# Altium project PCB_3U_Kasli.PrjPCB (part 6 of 7)

## Sheet FPGA_SDRAM.SchDoc: =ProjectName
size 420 x 297 mm; Author: G.K.; CompanyName: WUT; DrawnBy: G.K. and P.K.; Organization: WUT ISE; Address1: Warsaw Univeristy of Technology; Address2: Nowowiejska 15/19; DocumentNumber: 8; Revision: 1.1; SheetNumber: 8; SheetTotal: 12; EDA_Number: ARTIQ; Projet: ARTIQ/SINARA; ModifiedBy: -; CreateDate: XX/XX/XXXX; CheckedDate: -; Title2: FPGA_SDRAM.SchDoc; DivGrp: ISE; Designer: G.K. and P.K.; ModifiedDate: -; ProjectName: ARTIQ/SINARA
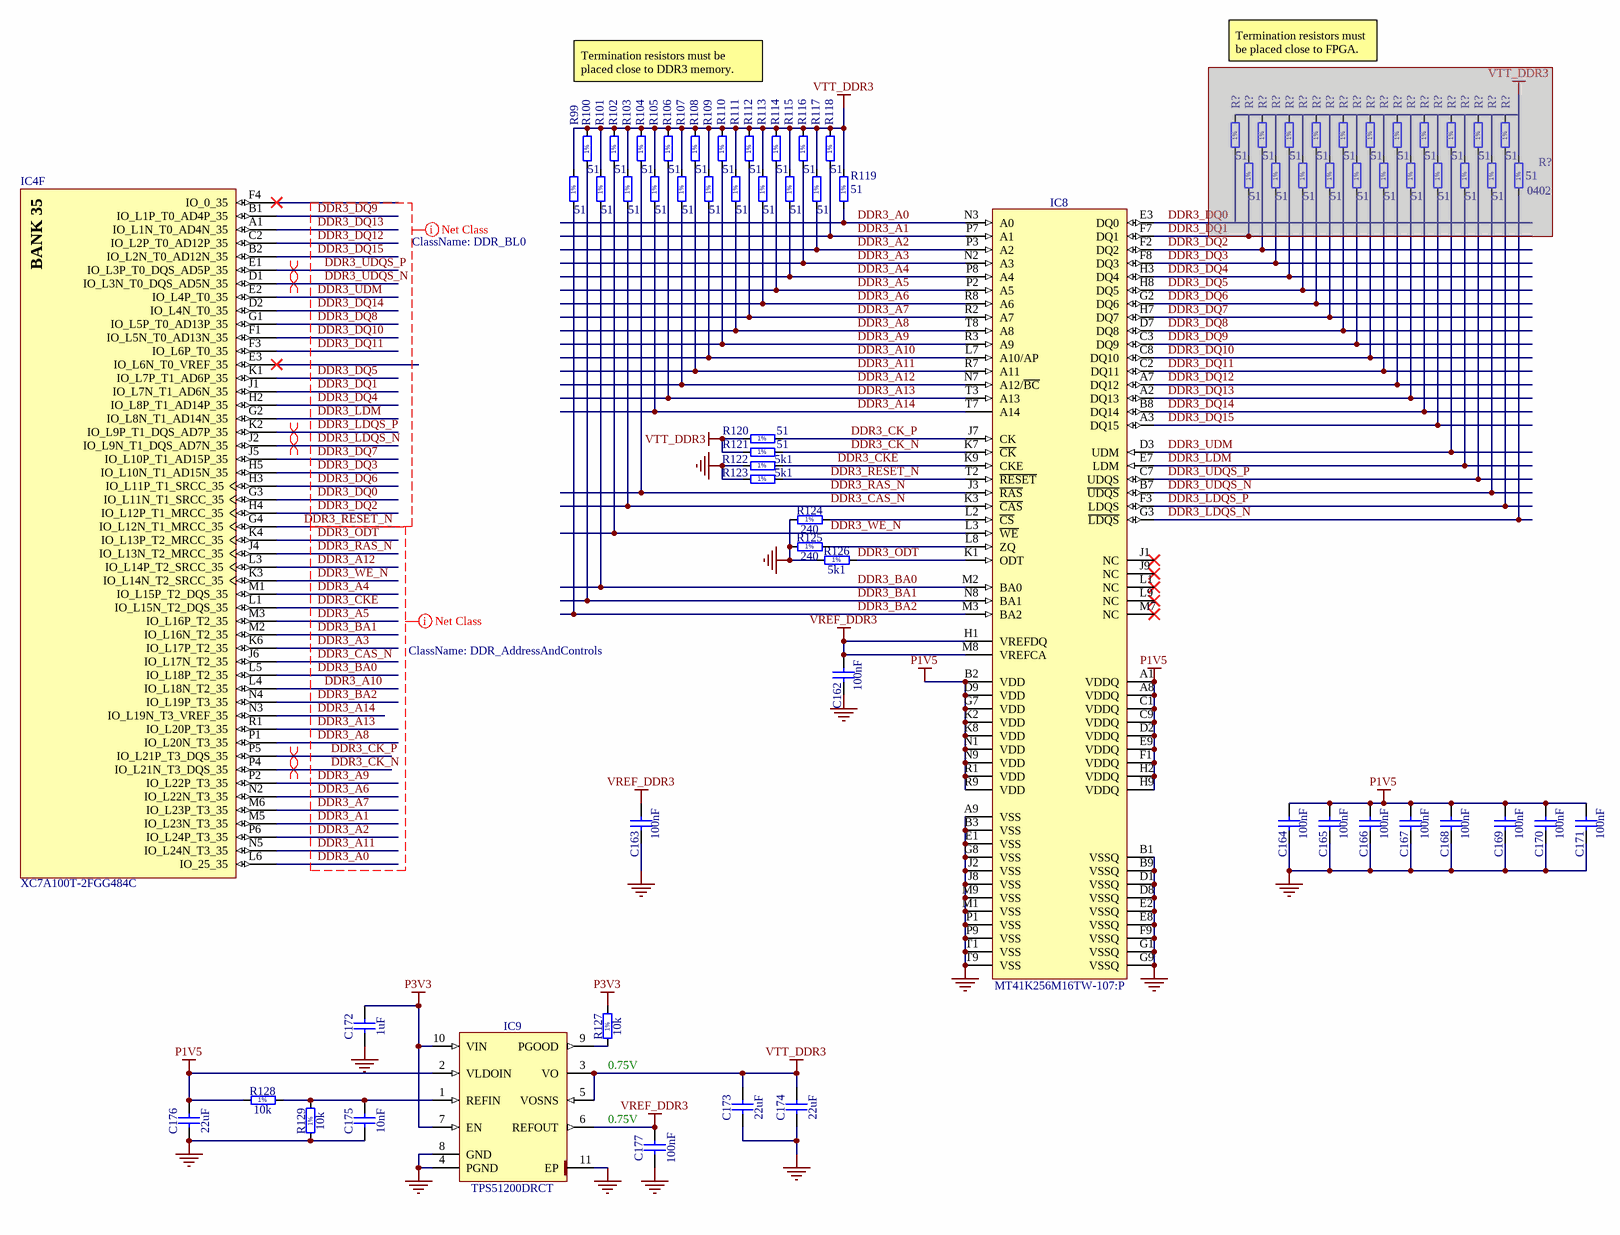
[diagram p9: FPGA_SDRAM.SchDoc]

### Parts
(Parts that share a designator on the sheet are numbered #1, #2 ... from top to bottom, then left to right.)
C162  100nF  [CAPC0603X33N]
C163  100nF  [CAPC0603X33N]
C164  100nF  [CAPC0603X33N]
C165  100nF  [CAPC0603X33N]
C166  100nF  [CAPC0603X33N]
C167  100nF  [CAPC0603X33N]
C168  100nF  [CAPC0603X33N]
C169  100nF  [CAPC0603X33N]
C170  100nF  [CAPC0603X33N]
C171  100nF  [CAPC0603X33N]
C172  1uF  [CAPC1005X55N]
C173  22uF  [CAPC1709X100N]
C174  22uF  [CAPC1709X100N]
C175  10nF  [CAPC1005X55N]
C176  22uF  [CAPC1709X100N]
C177  100nF  [CAPC0603X33N]
IC4  XC7A100T-2FGG484C  [FGG484]  (part F of 10)
IC8  MT41K256M16TW-107:P  [BGA96C80P9X16_800X1400X120]
IC9  TPS51200DRCT  [TEXAS_DRC (S-PVSON-N10)]
R99  51  [RESC1005X40N]
R100  51  [RESC1005X40N]
R101  51  [RESC1005X40N]
R102  51  [RESC1005X40N]
R103  51  [RESC1005X40N]
R104  51  [RESC1005X40N]
R105  51  [RESC1005X40N]
R106  51  [RESC1005X40N]
R107  51  [RESC1005X40N]
R108  51  [RESC1005X40N]
R109  51  [RESC1005X40N]
R110  51  [RESC1005X40N]
R111  51  [RESC1005X40N]
R112  51  [RESC1005X40N]
R113  51  [RESC1005X40N]
R114  51  [RESC1005X40N]
R115  51  [RESC1005X40N]
R116  51  [RESC1005X40N]
R117  51  [RESC1005X40N]
R118  51  [RESC1005X40N]
R119  51  [RESC1005X40N]
R120  51  [RESC1005X40N]
R121  51  [RESC1005X40N]
R122  5k1  [RESC1005X40N]
R123  5k1  [RESC1005X40N]
R124  240  [RESC1005X40N]
R125  240  [RESC1005X40N]
R126  5k1  [RESC1005X40N]
R127  10k  [RESC1005X40N]
R128  10k  [RESC1005X40N]
R129  10k  [RESC1005X40N]
R?#1  51  [RESC1005X40N]  (masked out: inside a compile mask, not in the netlist)
R?#2  51  [RESC1005X40N]  (masked out: inside a compile mask, not in the netlist)
R?#3  51  [RESC1005X40N]  (masked out: inside a compile mask, not in the netlist)
R?#4  51  [RESC1005X40N]  (masked out: inside a compile mask, not in the netlist)
R?#5  51  [RESC1005X40N]  (masked out: inside a compile mask, not in the netlist)
R?#6  51  [RESC1005X40N]  (masked out: inside a compile mask, not in the netlist)
R?#7  51  [RESC1005X40N]  (masked out: inside a compile mask, not in the netlist)
R?#8  51  [RESC1005X40N]  (masked out: inside a compile mask, not in the netlist)
R?#9  51  [RESC1005X40N]  (masked out: inside a compile mask, not in the netlist)
R?#10  51  [RESC1005X40N]  (masked out: inside a compile mask, not in the netlist)
R?#11  51  [RESC1005X40N]  (masked out: inside a compile mask, not in the netlist)
R?#12  51  [RESC1005X40N]  (masked out: inside a compile mask, not in the netlist)
R?#13  51  [RESC1005X40N]  (masked out: inside a compile mask, not in the netlist)
R?#14  51  [RESC1005X40N]  (masked out: inside a compile mask, not in the netlist)
R?#15  51  [RESC1005X40N]  (masked out: inside a compile mask, not in the netlist)
R?#16  51  [RESC1005X40N]  (masked out: inside a compile mask, not in the netlist)
R?#17  51  [RESC1005X40N]  (masked out: inside a compile mask, not in the netlist)
R?#18  51  [RESC1005X40N]  (masked out: inside a compile mask, not in the netlist)
R?#19  51  [RESC1005X40N]  (masked out: inside a compile mask, not in the netlist)
R?#20  51  [RESC1005X40N]  (masked out: inside a compile mask, not in the netlist)
R?#21  51  [RESC1005X40N]  (masked out: inside a compile mask, not in the netlist)
R?#22  51  Case: 0402  [RESC1005X40N]  (masked out: inside a compile mask, not in the netlist)

### Nets
GND: C162.1 C163.1 C164.1 C165.1 C166.1 C167.1 C168.1 C169.1 C170.1 C171.1 C172.1 C173.1 C174.1 C175.1 C176.1 C177.1 IC8.A9(VSS) IC8.B1(VSSQ) IC8.B3(VSS) IC8.B9(VSSQ) IC8.D1(VSSQ) IC8.D8(VSSQ) IC8.E1(VSS) IC8.E2(VSSQ) IC8.E8(VSSQ) IC8.F9(VSSQ) IC8.G1(VSSQ) IC8.G8(VSS) IC8.G9(VSSQ) IC8.J2(VSS) IC8.J8(VSS) IC8.M1(VSS) IC8.M9(VSS) IC8.P1(VSS) IC8.P9(VSS) IC8.T1(VSS) IC8.T9(VSS) IC9.4(PGND) IC9.8(GND) IC9.11(EP) R122.1 R123.1 R124.1 R125.1 R126.1 R129.1
P1V5: C164.2 C165.2 C166.2 C167.2 C168.2 C169.2 C170.2 C171.2 C176.2 IC8.A1(VDDQ) IC8.A8(VDDQ) IC8.B2(VDD) IC8.C1(VDDQ) IC8.C9(VDDQ) IC8.D2(VDDQ) IC8.D9(VDD) IC8.E9(VDDQ) IC8.F1(VDDQ) IC8.G7(VDD) IC8.H2(VDDQ) IC8.H9(VDDQ) IC8.K2(VDD) IC8.K8(VDD) IC8.N1(VDD) IC8.N9(VDD) IC8.R1(VDD) IC8.R9(VDD) IC9.2(VLDOIN) R128.1
P3V3: C172.2 IC9.7(EN) IC9.10(VIN) R127.2
VREF_DDR3: C162.2 C163.2 C177.2 IC8.H1(VREFDQ) IC8.M8(VREFCA) IC9.6(REFOUT)
VTT_DDR3: C173.2 C174.2 IC9.3(VO) IC9.5(VOSNS) R99.2 R100.2 R101.2 R102.2 R103.2 R104.2 R105.2 R106.2 R107.2 R108.2 R109.2 R110.2 R111.2 R112.2 R113.2 R114.2 R115.2 R116.2 R117.2 R118.2 R119.2 R120.1 R121.1
DDR3_A0: IC4.L6(IO_25_35) IC8.N3(A0) R119.1
DDR3_A1: IC4.M5(IO_L23N_T3_35) IC8.P7(A1) R118.1
DDR3_A2: IC4.P6(IO_L24P_T3_35) IC8.P3(A2) R117.1
DDR3_A3: IC4.K6(IO_L17P_T2_35) IC8.N2(A3) R116.1
DDR3_A4: IC4.M1(IO_L15P_T2_DQS_35) IC8.P8(A4) R115.1
DDR3_A5: IC4.M3(IO_L16P_T2_35) IC8.P2(A5) R114.1
DDR3_A6: IC4.N2(IO_L22N_T3_35) IC8.R8(A6) R113.1
DDR3_A7: IC4.M6(IO_L23P_T3_35) IC8.R2(A7) R112.1
DDR3_A8: IC4.P1(IO_L20N_T3_35) IC8.T8(A8) R111.1
DDR3_A9: IC4.P2(IO_L22P_T3_35) IC8.R3(A9) R110.1
DDR3_A10: IC4.L4(IO_L18N_T2_35) IC8.L7(A10/AP) R109.1
DDR3_A11: IC4.N5(IO_L24N_T3_35) IC8.R7(A11) R108.1
DDR3_A12: IC4.L3(IO_L14P_T2_SRCC_35) IC8.N7(A12/~{BC}) R107.1
DDR3_A13: IC4.R1(IO_L20P_T3_35) IC8.T3(A13) R106.1
DDR3_A14: IC4.N3(IO_L19N_T3_VREF_35) IC8.T7(A14) R105.1
DDR3_BA0: IC4.L5(IO_L18P_T2_35) IC8.M2(BA0) R101.1
DDR3_BA1: IC4.M2(IO_L16N_T2_35) IC8.N8(BA1) R100.1
DDR3_BA2: IC4.N4(IO_L19P_T3_35) IC8.M3(BA2) R99.1
DDR3_CAS_N: IC4.J6(IO_L17N_T2_35) IC8.K3(~{CAS}) R103.1
DDR3_CK_N: IC4.P4(IO_L21N_T3_DQS_35) IC8.K7(~{CK}) R121.2
DDR3_CK_P: IC4.P5(IO_L21P_T3_DQS_35) IC8.J7(CK) R120.2
DDR3_CKE: IC4.L1(IO_L15N_T2_DQS_35) IC8.K9(CKE) R122.2
DDR3_DQ0: IC4.G3(IO_L11N_T1_SRCC_35) IC8.E3(DQ0)
DDR3_DQ1: IC4.J1(IO_L7N_T1_AD6N_35) IC8.F7(DQ1)
DDR3_DQ2: IC4.H4(IO_L12P_T1_MRCC_35) IC8.F2(DQ2)
DDR3_DQ3: IC4.H5(IO_L10N_T1_AD15N_35) IC8.F8(DQ3)
DDR3_DQ4: IC4.H2(IO_L8P_T1_AD14P_35) IC8.H3(DQ4)
DDR3_DQ5: IC4.K1(IO_L7P_T1_AD6P_35) IC8.H8(DQ5)
DDR3_DQ6: IC4.H3(IO_L11P_T1_SRCC_35) IC8.G2(DQ6)
DDR3_DQ7: IC4.J5(IO_L10P_T1_AD15P_35) IC8.H7(DQ7)
DDR3_DQ8: IC4.G1(IO_L5P_T0_AD13P_35) IC8.D7(DQ8)
DDR3_DQ9: IC4.B1(IO_L1P_T0_AD4P_35) IC8.C3(DQ9)
DDR3_DQ10: IC4.F1(IO_L5N_T0_AD13N_35) IC8.C8(DQ10)
DDR3_DQ11: IC4.F3(IO_L6P_T0_35) IC8.C2(DQ11)
DDR3_DQ12: IC4.C2(IO_L2P_T0_AD12P_35) IC8.A7(DQ12)
DDR3_DQ13: IC4.A1(IO_L1N_T0_AD4N_35) IC8.A2(DQ13)
DDR3_DQ14: IC4.D2(IO_L4N_T0_35) IC8.B8(DQ14)
DDR3_DQ15: IC4.B2(IO_L2N_T0_AD12N_35) IC8.A3(DQ15)
DDR3_LDM: IC4.G2(IO_L8N_T1_AD14N_35) IC8.E7(LDM)
DDR3_LDQS_N: IC4.J2(IO_L9N_T1_DQS_AD7N_35) IC8.G3(~{LDQS})
DDR3_LDQS_P: IC4.K2(IO_L9P_T1_DQS_AD7P_35) IC8.F3(LDQS)
DDR3_ODT: IC4.K4(IO_L13P_T2_MRCC_35) IC8.K1(ODT) R126.2
DDR3_RAS_N: IC4.J4(IO_L13N_T2_MRCC_35) IC8.J3(~{RAS}) R104.1
DDR3_RESET_N: IC4.G4(IO_L12N_T1_MRCC_35) IC8.T2(~{RESET}) R123.2
DDR3_UDM: IC4.E2(IO_L4P_T0_35) IC8.D3(UDM)
DDR3_UDQS_N: IC4.D1(IO_L3N_T0_DQS_AD5N_35) IC8.B7(~{UDQS})
DDR3_UDQS_P: IC4.E1(IO_L3P_T0_DQS_AD5P_35) IC8.C7(UDQS)
DDR3_WE_N: IC4.K3(IO_L14N_T2_SRCC_35) IC8.L3(~{WE}) R102.1
NetC175_2: C175.2 IC9.1(REFIN) R128.2 R129.2
NetIC8_L2: IC8.L2(~{CS}) R124.2
NetIC8_L8: IC8.L8(ZQ) R125.2
NetIC9_9: IC9.9(PGOOD) R127.1

Not connected (* = marked no-connect by the designer): IC4 E3(IO_L6N_T0_VREF_35)* F4(IO_0_35)*; IC8 J1(NC)* J9(NC)* L1(NC)* L9(NC)* M7(NC)*

### Layout directives
differential pair: DDR3_CK_N, DDR3_CK_P, DDR3_LDQS_N, DDR3_LDQS_P, DDR3_UDQS_N, DDR3_UDQS_P
net class DDR_AddressAndControls; net class 50Ohm: DDR3_A0, DDR3_A1, DDR3_A2, DDR3_A3, DDR3_A4, DDR3_A5, DDR3_A6, DDR3_A7, DDR3_A8, DDR3_A9, DDR3_A10, DDR3_A11, DDR3_A12, DDR3_A13, DDR3_A14, DDR3_BA0, DDR3_BA1, DDR3_BA2, DDR3_CAS_N, DDR3_CK_N, DDR3_CK_P, DDR3_CKE, DDR3_ODT, DDR3_RAS_N, DDR3_WE_N
net class DDR_BL0; net class 50Ohm: DDR3_DQ0, DDR3_DQ1, DDR3_DQ2, DDR3_DQ3, DDR3_DQ4, DDR3_DQ5, DDR3_DQ6, DDR3_DQ7, DDR3_DQ8, DDR3_DQ9, DDR3_DQ10, DDR3_DQ11, DDR3_DQ12, DDR3_DQ13, DDR3_DQ14, DDR3_DQ15, DDR3_LDM, DDR3_LDQS_N, DDR3_LDQS_P, DDR3_UDM, DDR3_UDQS_N, DDR3_UDQS_P

### Notes on the sheet
- Termination resistors must be placed close to DDR3 memory.
- Termination resistors must be placed close to FPGA.
- (near R127) 0.75V
- (near C177) 0.75V
- Project/Equipment
- Document
- Designer
- Drawn by
- Check.by
- File
- Last Mod.
- Print Date
- Sheet
- Size
- A3
- of
- Rev
- (in symbol CMP-0364-00026-3, part F) BANK 35
- (in symbol R0402_5K1_1%_0.0625W_100PPM) 1%
- (in symbol R0402_10K_1%_0.0625W_100PPM) 1%
- (in symbol R0402_51R_1%_0.0625W_100PPM) 1%
- (in symbol R0402_240R_1%_0.0625W_100PPM) 1%

### Library data of the parts
C162-C171 C177 = CC0201_100NF_6.3V_10%_X5R: Non-polarised capacitor; Part Description: SMD Multilayer Chip Ceramic Capacitor; Manufacturer: GENERIC; Manufacturer1 Part Number: 02016D104KAT2A; Voltage: 6.3V; TC: X5R; Tolerance: ±10%; Part Number: CC0201_100NF_6.3V_10%_X5R; Component Kind: Standard; Component Type: Standard; Pin Count: 2; Value: 100nF; Status: Not Recommended; Manufacturer Part Number: CC0201_100NF_6.3V_10%_X5R; Case: 0201; Mounted: Yes; Socket: No; SMD: Yes; Sense: No; Manufacturer1 Example: AVX; Manufacturer1 ComponentHeight: 0.33mm; HelpURL: \\cern.ch\dfs\Applications\Altium\Datasheets\CC0201_X5R_AVX.pdf; Author: CERN DEM JLC
  C162-C171: CreateDate: 2007-12-03; LatestRevisionDate: 2007-12-03
  C177: CreateDate: 03.12.2007; LatestRevisionDate: 03.12.2007
C172 = CC0402_1UF_16V_10%_X5R: Non-polarised capacitor; Part Description: SMD Multilayer Chip Ceramic Capacitor; Manufacturer: GENERIC; Manufacturer1 Part Number: C1005X5R1C105KT; Voltage: 16V; TC: X5R; Tolerance: ±10%; Part Number: CC0402_1UF_16V_10%_X5R; Component Kind: Standard; Component Type: Standard; Pin Count: 2; Value: 1uF; Status: Preferred; Manufacturer Part Number: CC0402_1UF_16V_10%_X5R; Case: 0402; Mounted: Yes; Socket: No; SMD: Yes; Manufacturer1 Example: TDK; Manufacturer1 ComponentHeight: 0.55mm; HelpURL: \\cern.ch\dfs\Applications\Altium\Datasheets\CC0402_X5R_TDK_C.pdf; Author: CERN DEM JLC; CreateDate: 25.10.2012; LatestRevisionDate: 25.10.2012; Sense: No
C173 C174 C176 = CC0603_22UF_6.3V_20%_X5R: Non-polarised capacitor; Part Description: SMD Multilayer Chip Ceramic Capacitor; Manufacturer: GENERIC; Manufacturer1 Part Number: C1608X5R0J226M080AC; Voltage: 6.3V; TC: X5R; Tolerance: ±20%; Part Number: CC0603_22UF_6.3V_20%_X5R; Component Kind: Standard; Component Type: Standard; Pin Count: 2; Value: 22uF; Status: None; Manufacturer Part Number: CC0603_22UF_6.3V_20%_X5R; Case: 0603; Mounted: Yes; Socket: No; SMD: Yes; Manufacturer1 Example: TDK; Manufacturer1 ComponentHeight: 1mm; HelpURL: \\cern.ch\dfs\Applications\Altium\Datasheets\CC0603_X5R_TDK_C.pdf; Author: CERN DEM JLC; CreateDate: 16.12.2013; LatestRevisionDate: 13.09.2016; Sense: No
C175 = CC0402_10NF_16V_10%_X7R: Non-polarised capacitor; Part Description: SMD Multilayer Chip Ceramic Capacitor; Manufacturer: GENERIC; Manufacturer1 Part Number: 223878715636; Voltage: 16V; TC: X7R; Tolerance: ±10%; Part Number: CC0402_10NF_16V_10%_X7R; Component Kind: Standard; Component Type: Standard; Pin Count: 2; Value: 10nF; Status: Not Recommended; Manufacturer Part Number: CC0402_10NF_16V_10%_X7R; Case: 0402; Mounted: Yes; Socket: No; SMD: Yes; Manufacturer1 Example: PHYCOMP; Manufacturer1 ComponentHeight: 0.55mm; HelpURL: \\cern.ch\dfs\Applications\Altium\Datasheets\CC0402_X7R_PHYCOMP.pdf; Author: CERN DEM JLC; CreateDate: 03.12.2007; LatestRevisionDate: 03.12.2007; Sense: No
IC4 = CMP-0364-00026-3: Artix-7 FPGA, 285 User I/Os, 4 GTP, 484-Ball BGA, Speed Grade 2, Commercial Grade, Pb-Free; Manufacturer: Xilinx; Max User I/O: 300; Clock Mgmt Tiles (CMTs): 6; Logic Cells: 101440; Block RAM Blocks (36Kb): 135; Block RAM Blocks (18Kb): 270; Speed Grade: -2; CLBs (Slices): 15850; Block RAM Blocks (Max Kb): 4860; DSP48E1 Slices: 240; RoHS: Pb-Free; ComponentLink3URL: http://www.xilinx.com/support/documentation/data_sheets/ds181_Artix_7_Data_Sheet.pdf; NexusDeviceID: XC7A100T-2FGG484C; DatasheetVersion: v1.12; Mounting Technology: Surface Mount; PackageDescription: Wire-Bond Fine-Pitch BGA, Body 23 x 23 mm, 1.0 mm Pitch; PackageReference: FGG484; ComponentLink2Description: Package Specification; Code_JEDEC: MS-034-AAJ-1; ComponentLink2URL: http://www.xilinx.com/support/documentation/user_guides/ug475_7Series_Pkg_Pinout.pdf; ComponentLink3Description: DC and Switching Characteristics; Generic Part Number: XC7A100T; ComponentLink4Description: Package File; ComponentLink4URL: http://www.xilinx.com/support/packagefiles/a7packages/xc7a100tfgg484pkg.txt; ComponentLink1URL: http://www.xilinx.com/support/documentation/data_sheets/ds180_7Series_Overview.pdf; PartNumber: XC7A100T-2FGG484C; ComponentLink5URL: http://www.xilinx.com/support/documentation/user_guides/ug475_7Series_Pkg_Pinout.pdf; PackageVersion: Rev 1.8; ComponentLink5Description: Packaging and Pinout; ComponentLink1Description: Datasheet; CLBs (Max Distributed RAM Kb): 1188; ClassName: Artix
IC8 = MT41K256M16TW-107:P: 32 Meg x 16 x 8 Banks DDR3L SDRAM; Part Description: +1.5V, 4Gb (32Meg x 16 x 8 banks) DDR3L SDRAM; Manufacturer: MICRON TECHNOLOGY; PressFit: No; Bonding: No; Part Number: MT41K256M16TW-107:P; Component Kind: Standard; Component Type: Standard; Device: MT41K256M16TW-107:P; PackageDescription: BGA 0.8mm, Pitch, Square 96 Pin, 9 Columns x 16 Rows, Body 14mm X 8mm X 1.2mm H; Manufacturer Part Number: MT41K256M16TW-107:P; Pin Count: 96; Case: BGA96; Mounted: Yes; Socket: No; SMD: Yes; Sense: No; ComponentHeight: 1.2mm; HelpURL: \\cern.ch\dfs\Applications\Altium\Datasheets\MT41K256M16TW-107-P.pdf; Author: CERN DEM MR; CreateDate: 2015-12-14; LatestRevisionDate: 2015-12-14
IC9 = TPS51200DRCT: Sink/Source DDR Termination Regulator; Part Description: 3.3V Sink/Source DDR Termination Regulator; Manufacturer: TEXAS INSTRUMENTS; PressFit: No; Bonding: No; Part Number: TPS51200DRCT; Component Kind: Standard; Component Type: Standard; Device: TPS51200DRCT; PackageDescription: SON, 0.50mm Pitch, 10-pin, 3.00mm W  X 3.00mm L X 1.00mm Height, (w/thermal tab 1.75 X 2.50 mm); Manufacturer Part Number: TPS51200DRCT; Pin Count: 11; Case: SON10; Mounted: Yes; Socket: No; SMD: Yes; Sense: No; ComponentHeight: 1mm; HelpURL: \\cern.ch\dfs\Applications\Altium\Datasheets\TPS51200DRCT.pdf; Author: CERN DEM JLC; CreateDate: 03.02.2010; LatestRevisionDate: 06.11.2013
R99-R121 R?#1-R?#22 = R0402_51R_1%_0.0625W_100PPM: Resistor - 1%; Part Description: General Purpose Thick Film Chip Resistor; Manufacturer: GENERIC; Manufacturer1 Part Number: 232270675109; TC: ±100ppm/°C; Table: Resistors SMD; Part Number: R0402_51R_1%_0.0625W_100PPM; Component Kind: Standard; Component Type: Standard; Pin Count: 2; Value: 51; Status: Not recommended; Power: 0.0625W; Tolerance: ±1%; Manufacturer Part Number: R0402_51R_1%_0.0625W_100PPM; Mounted: Yes; Socket: No; SMD: Yes; Manufacturer1 Example: PHYCOMP; Manufacturer1 ComponentHeight: 0.4mm; HelpURL: \\cern.ch\dfs\Applications\Altium\Datasheets\R0402_Phycomp_RC0402.pdf; Author: CERN DEM JLC; CreateDate: 03/12/2007; LatestRevisionDate: 13/03/2008
  R99-R118 R120 R121 R?#1-R?#21: Case: 0402
R122 R123 R126 = R0402_5K1_1%_0.0625W_100PPM: Resistor - 1%; Part Description: General Purpose Thick Film Chip Resistor; Manufacturer: GENERIC; Manufacturer1 Part Number: 232270675102L; TC: ±100ppm/°C; PressFit: No; Part Number: R0402_5K1_1%_0.0625W_100PPM; Component Kind: Standard; Component Type: Standard; Pin Count: 2; Value: 5k1; Status: Not Recommended; Power: 0.0625W; Tolerance: ±1%; Manufacturer Part Number: R0402_5K1_1%_0.0625W_100PPM; Case: 0402; Mounted: Yes; Sense: No; Socket: No; SMD: Yes; Manufacturer1 Example: YAGEO PHYCOMP; Manufacturer1 ComponentHeight: 0.4mm; HelpURL: \\cern.ch\dfs\Applications\Altium\Datasheets\R0402_Phycomp_RC0402.pdf; Author: CERN DEM JLC; CreateDate: 03.12.2007; LatestRevisionDate: 17.10.2012
R124 R125 = R0402_240R_1%_0.0625W_100PPM: Resistor - 1%; Part Description: General Purpose Thick Film Chip Resistor; Manufacturer: GENERIC; Manufacturer1 Part Number: 232270672401L; TC: ±100ppm/°C; PressFit: No; Part Number: R0402_240R_1%_0.0625W_100PPM; Component Kind: Standard; Component Type: Standard; Pin Count: 2; Value: 240; Status: Not Recommended; Power: 0.0625W; Tolerance: ±1%; Manufacturer Part Number: R0402_240R_1%_0.0625W_100PPM; Case: 0402; Mounted: Yes; Sense: No; Socket: No; SMD: Yes; Manufacturer1 Example: YAGEO PHYCOMP; Manufacturer1 ComponentHeight: 0.4mm; HelpURL: \\cern.ch\dfs\Applications\Altium\Datasheets\R0402_Phycomp_RC0402.pdf; Author: CERN DEM JLC; CreateDate: 03.12.2007; LatestRevisionDate: 17.10.2012
R127-R129 = R0402_10K_1%_0.0625W_100PPM: Resistor - 1%; Part Description: General Purpose Thick Film Chip Resistor; Manufacturer: GENERIC; Manufacturer1 Part Number: 232270671003L; TC: ±100ppm/°C; PressFit: No; Part Number: R0402_10K_1%_0.0625W_100PPM; Component Kind: Standard; Component Type: Standard; Pin Count: 2; Value: 10k; Status: Not Recommended; Power: 0.0625W; Tolerance: ±1%; Manufacturer Part Number: R0402_10K_1%_0.0625W_100PPM; Case: 0402; Mounted: Yes; Socket: No; SMD: Yes; Manufacturer1 Example: YAGEO PHYCOMP; Manufacturer1 ComponentHeight: 0.4mm; HelpURL: \\cern.ch\dfs\Applications\Altium\Datasheets\R0402_Phycomp_RC0402.pdf; Author: CERN DEM JLC; CreateDate: 03.12.2007; LatestRevisionDate: 17.10.2012; Sense: No

## Sheet IDC_EXT_Connectors.SchDoc: =ProjectName
size 420 x 297 mm; Author: G.K.; CompanyName: WUT; DrawnBy: G.K. and P.K.; Organization: WUT ISE; Address1: Warsaw Univeristy of Technology; Address2: Nowowiejska 15/19; DocumentNumber: 3; Revision: 1.1; SheetNumber: 3; SheetTotal: 12; EDA_Number: ARTIQ; Projet: ARTIQ/SINARA; ModifiedBy: -; CreateDate: XX/XX/XXXX; CheckedDate: -; Title2: IDC_EXT_Connectors.SchDoc; DivGrp: ISE; Designer: G.K.; ModifiedDate: -; ProjectName: ARTIQ/SINARA
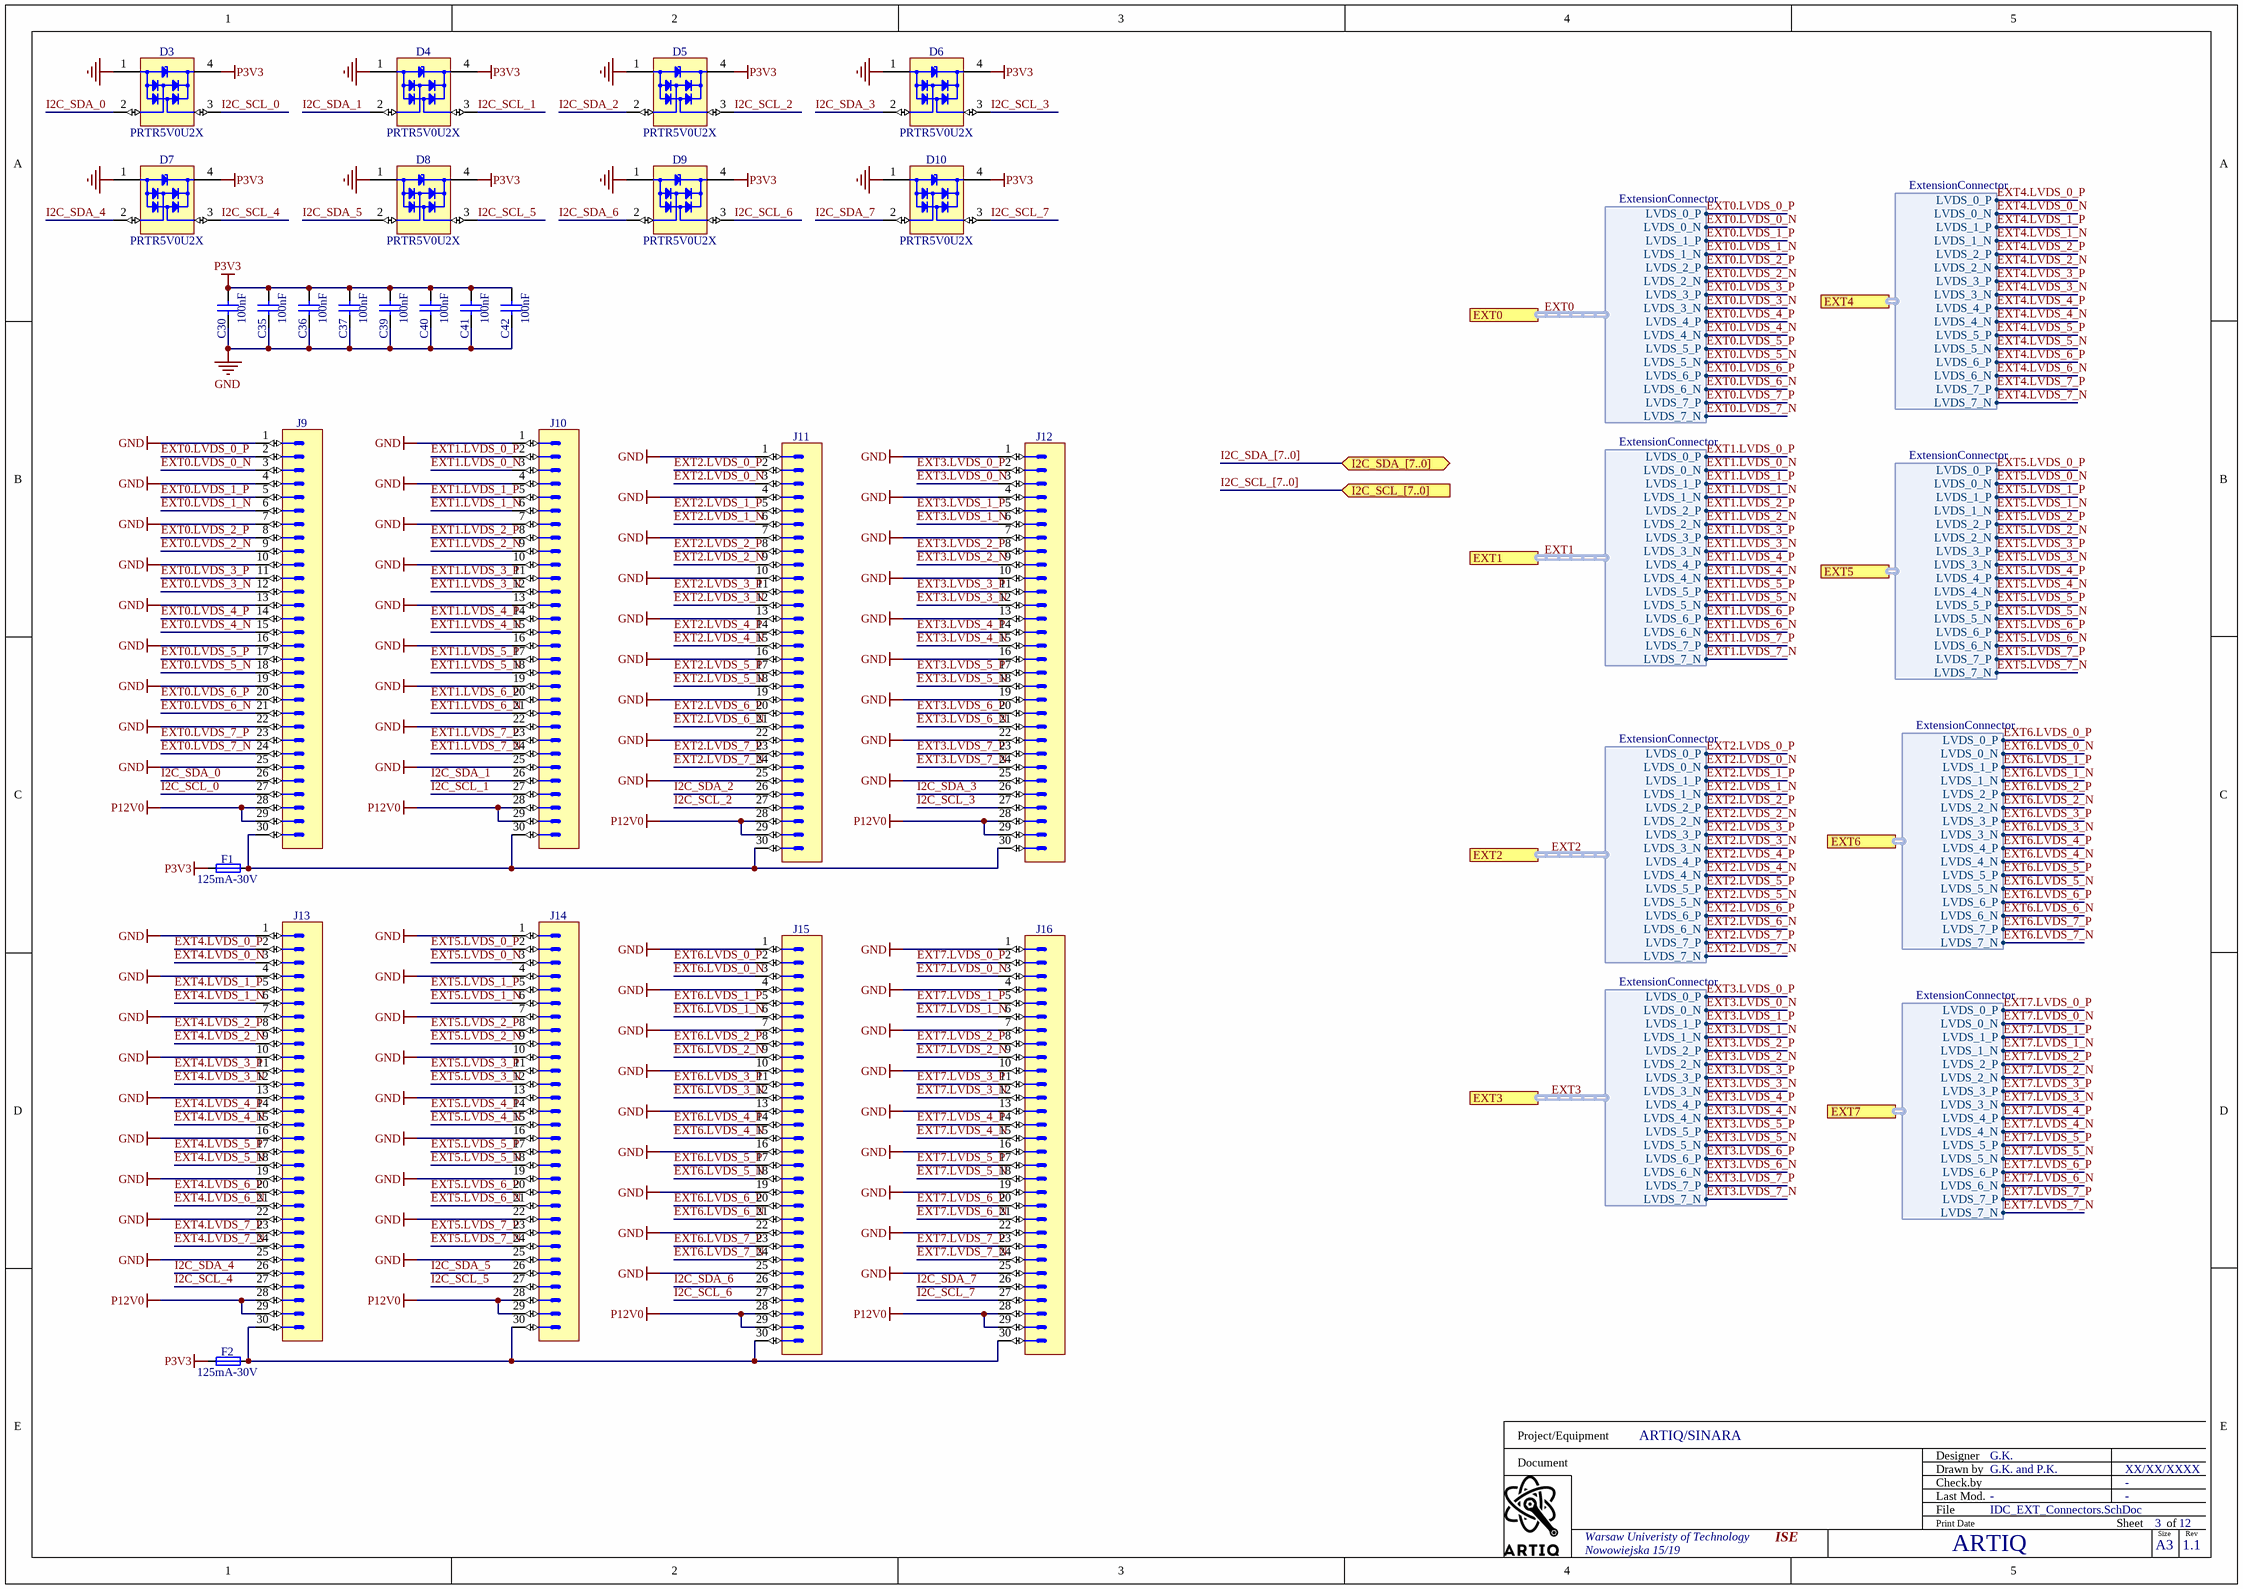
[diagram p10: IDC_EXT_Connectors.SchDoc]

### Parts
C30  100nF  [CAPC0603X33N]
C35  100nF  [CAPC0603X33N]
C36  100nF  [CAPC0603X33N]
C37  100nF  [CAPC0603X33N]
C39  100nF  [CAPC0603X33N]
C40  100nF  [CAPC0603X33N]
C41  100nF  [CAPC0603X33N]
C42  100nF  [CAPC0603X33N]
D3  PRTR5V0U2X  [SOT190P230X110-4N]
D4  PRTR5V0U2X  [SOT190P230X110-4N]
D5  PRTR5V0U2X  [SOT190P230X110-4N]
D6  PRTR5V0U2X  [SOT190P230X110-4N]
D7  PRTR5V0U2X  [SOT190P230X110-4N]
D8  PRTR5V0U2X  [SOT190P230X110-4N]
D9  PRTR5V0U2X  [SOT190P230X110-4N]
D10  PRTR5V0U2X  [SOT190P230X110-4N]
F1  125mA-30V  [FUSR_LITTELFUSE_1206L012]
F2  125mA-30V  [FUSR_LITTELFUSE_1206L012]
J9  (no value)  [3M_N2530-6002RB]
J10  (no value)  [3M_N2530-6002RB]
J11  (no value)  [3M_N2530-6002RB]
J12  (no value)  [3M_N2530-6002RB]
J13  (no value)  [3M_N2530-6002RB]
J14  (no value)  [3M_N2530-6002RB]
J15  (no value)  [3M_N2530-6002RB]
J16  (no value)  [3M_N2530-6002RB]

### Ports
EXT0 (harness ExtensionConnector), EXT1 (harness ExtensionConnector), EXT2 (harness ExtensionConnector), EXT3 (harness ExtensionConnector), EXT4 (harness ExtensionConnector), EXT5 (harness ExtensionConnector), EXT6 (harness ExtensionConnector), EXT7 (harness ExtensionConnector), I2C_SCL_[7..0] (in), I2C_SDA_[7..0] (bidir)

### Harnesses
ExtensionConnector: LVDS_0_N, LVDS_0_P, LVDS_1_N, LVDS_1_P, LVDS_2_N, LVDS_2_P, LVDS_3_N, LVDS_3_P, LVDS_4_N, LVDS_4_P, LVDS_5_N, LVDS_5_P, LVDS_6_N, LVDS_6_P, LVDS_7_N, LVDS_7_P

### Nets
GND: C30.1 C35.1 C36.1 C37.1 C39.1 C40.1 C41.1 C42.1 D3.1(GND) D4.1(GND) D5.1(GND) D6.1(GND) D7.1(GND) D8.1(GND) D9.1(GND) D10.1(GND) J9.1 J9.4 J9.7 J9.10 J9.13 J9.16 J9.19 J9.22 J9.25 J10.1 J10.4 J10.7 J10.10 J10.13 J10.16 J10.19 J10.22 J10.25 J11.1 J11.4 J11.7 J11.10 J11.13 J11.16 J11.19 J11.22 J11.25 J12.1 J12.4 J12.7 J12.10 J12.13 J12.16 J12.19 J12.22 J12.25 J13.1 J13.4 J13.7 J13.10 J13.13 J13.16 J13.19 J13.22 J13.25 J14.1 J14.4 J14.7 J14.10 J14.13 J14.16 J14.19 J14.22 J14.25 J15.1 J15.4 J15.7 J15.10 J15.13 J15.16 J15.19 J15.22 J15.25 J16.1 J16.4 J16.7 J16.10 J16.13 J16.16 J16.19 J16.22 J16.25
P3V3: C30.2 C35.2 C36.2 C37.2 C39.2 C40.2 C41.2 C42.2 D3.4(VCC) D4.4(VCC) D5.4(VCC) D6.4(VCC) D7.4(VCC) D8.4(VCC) D9.4(VCC) D10.4(VCC) F1.1 F2.1
P12V0: J9.28 J9.29 J10.28 J10.29 J11.28 J11.29 J12.28 J12.29 J13.28 J13.29 J14.28 J14.29 J15.28 J15.29 J16.28 J16.29
EXT0.LVDS_0_N: J9.3 ; port EXT0.LVDS_0_N
EXT0.LVDS_0_P: J9.2 ; port EXT0.LVDS_0_P
EXT0.LVDS_1_N: J9.6 ; port EXT0.LVDS_1_N
EXT0.LVDS_1_P: J9.5 ; port EXT0.LVDS_1_P
EXT0.LVDS_2_N: J9.9 ; port EXT0.LVDS_2_N
EXT0.LVDS_2_P: J9.8 ; port EXT0.LVDS_2_P
EXT0.LVDS_3_N: J9.12 ; port EXT0.LVDS_3_N
EXT0.LVDS_3_P: J9.11 ; port EXT0.LVDS_3_P
EXT0.LVDS_4_N: J9.15 ; port EXT0.LVDS_4_N
EXT0.LVDS_4_P: J9.14 ; port EXT0.LVDS_4_P
EXT0.LVDS_5_N: J9.18 ; port EXT0.LVDS_5_N
EXT0.LVDS_5_P: J9.17 ; port EXT0.LVDS_5_P
EXT0.LVDS_6_N: J9.21 ; port EXT0.LVDS_6_N
EXT0.LVDS_6_P: J9.20 ; port EXT0.LVDS_6_P
EXT0.LVDS_7_N: J9.24 ; port EXT0.LVDS_7_N
EXT0.LVDS_7_P: J9.23 ; port EXT0.LVDS_7_P
EXT1.LVDS_0_N: J10.3 ; port EXT1.LVDS_0_N
EXT1.LVDS_0_P: J10.2 ; port EXT1.LVDS_0_P
EXT1.LVDS_1_N: J10.6 ; port EXT1.LVDS_1_N
EXT1.LVDS_1_P: J10.5 ; port EXT1.LVDS_1_P
EXT1.LVDS_2_N: J10.9 ; port EXT1.LVDS_2_N
EXT1.LVDS_2_P: J10.8 ; port EXT1.LVDS_2_P
EXT1.LVDS_3_N: J10.12 ; port EXT1.LVDS_3_N
EXT1.LVDS_3_P: J10.11 ; port EXT1.LVDS_3_P
EXT1.LVDS_4_N: J10.15 ; port EXT1.LVDS_4_N
EXT1.LVDS_4_P: J10.14 ; port EXT1.LVDS_4_P
EXT1.LVDS_5_N: J10.18 ; port EXT1.LVDS_5_N
EXT1.LVDS_5_P: J10.17 ; port EXT1.LVDS_5_P
EXT1.LVDS_6_N: J10.21 ; port EXT1.LVDS_6_N
EXT1.LVDS_6_P: J10.20 ; port EXT1.LVDS_6_P
EXT1.LVDS_7_N: J10.24 ; port EXT1.LVDS_7_N
EXT1.LVDS_7_P: J10.23 ; port EXT1.LVDS_7_P
EXT2.LVDS_0_N: J11.3 ; port EXT2.LVDS_0_N
EXT2.LVDS_0_P: J11.2 ; port EXT2.LVDS_0_P
EXT2.LVDS_1_N: J11.6 ; port EXT2.LVDS_1_N
EXT2.LVDS_1_P: J11.5 ; port EXT2.LVDS_1_P
EXT2.LVDS_2_N: J11.9 ; port EXT2.LVDS_2_N
EXT2.LVDS_2_P: J11.8 ; port EXT2.LVDS_2_P
EXT2.LVDS_3_N: J11.12 ; port EXT2.LVDS_3_N
EXT2.LVDS_3_P: J11.11 ; port EXT2.LVDS_3_P
EXT2.LVDS_4_N: J11.15 ; port EXT2.LVDS_4_N
EXT2.LVDS_4_P: J11.14 ; port EXT2.LVDS_4_P
EXT2.LVDS_5_N: J11.18 ; port EXT2.LVDS_5_N
EXT2.LVDS_5_P: J11.17 ; port EXT2.LVDS_5_P
EXT2.LVDS_6_N: J11.21 ; port EXT2.LVDS_6_N
EXT2.LVDS_6_P: J11.20 ; port EXT2.LVDS_6_P
EXT2.LVDS_7_N: J11.24 ; port EXT2.LVDS_7_N
EXT2.LVDS_7_P: J11.23 ; port EXT2.LVDS_7_P
EXT3.LVDS_0_N: J12.3 ; port EXT3.LVDS_0_N
EXT3.LVDS_0_P: J12.2 ; port EXT3.LVDS_0_P
EXT3.LVDS_1_N: J12.6 ; port EXT3.LVDS_1_N
EXT3.LVDS_1_P: J12.5 ; port EXT3.LVDS_1_P
EXT3.LVDS_2_N: J12.9 ; port EXT3.LVDS_2_N
EXT3.LVDS_2_P: J12.8 ; port EXT3.LVDS_2_P
EXT3.LVDS_3_N: J12.12 ; port EXT3.LVDS_3_N
EXT3.LVDS_3_P: J12.11 ; port EXT3.LVDS_3_P
EXT3.LVDS_4_N: J12.15 ; port EXT3.LVDS_4_N
EXT3.LVDS_4_P: J12.14 ; port EXT3.LVDS_4_P
EXT3.LVDS_5_N: J12.18 ; port EXT3.LVDS_5_N
EXT3.LVDS_5_P: J12.17 ; port EXT3.LVDS_5_P
EXT3.LVDS_6_N: J12.21 ; port EXT3.LVDS_6_N
EXT3.LVDS_6_P: J12.20 ; port EXT3.LVDS_6_P
EXT3.LVDS_7_N: J12.24 ; port EXT3.LVDS_7_N
EXT3.LVDS_7_P: J12.23 ; port EXT3.LVDS_7_P
EXT4.LVDS_0_N: J13.3 ; port EXT4.LVDS_0_N
EXT4.LVDS_0_P: J13.2 ; port EXT4.LVDS_0_P
EXT4.LVDS_1_N: J13.6 ; port EXT4.LVDS_1_N
EXT4.LVDS_1_P: J13.5 ; port EXT4.LVDS_1_P
EXT4.LVDS_2_N: J13.9 ; port EXT4.LVDS_2_N
EXT4.LVDS_2_P: J13.8 ; port EXT4.LVDS_2_P
EXT4.LVDS_3_N: J13.12 ; port EXT4.LVDS_3_N
EXT4.LVDS_3_P: J13.11 ; port EXT4.LVDS_3_P
EXT4.LVDS_4_N: J13.15 ; port EXT4.LVDS_4_N
EXT4.LVDS_4_P: J13.14 ; port EXT4.LVDS_4_P
EXT4.LVDS_5_N: J13.18 ; port EXT4.LVDS_5_N
EXT4.LVDS_5_P: J13.17 ; port EXT4.LVDS_5_P
EXT4.LVDS_6_N: J13.21 ; port EXT4.LVDS_6_N
EXT4.LVDS_6_P: J13.20 ; port EXT4.LVDS_6_P
EXT4.LVDS_7_N: J13.24 ; port EXT4.LVDS_7_N
EXT4.LVDS_7_P: J13.23 ; port EXT4.LVDS_7_P
EXT5.LVDS_0_N: J14.3 ; port EXT5.LVDS_0_N
EXT5.LVDS_0_P: J14.2 ; port EXT5.LVDS_0_P
EXT5.LVDS_1_N: J14.6 ; port EXT5.LVDS_1_N
EXT5.LVDS_1_P: J14.5 ; port EXT5.LVDS_1_P
EXT5.LVDS_2_N: J14.9 ; port EXT5.LVDS_2_N
EXT5.LVDS_2_P: J14.8 ; port EXT5.LVDS_2_P
EXT5.LVDS_3_N: J14.12 ; port EXT5.LVDS_3_N
EXT5.LVDS_3_P: J14.11 ; port EXT5.LVDS_3_P
EXT5.LVDS_4_N: J14.15 ; port EXT5.LVDS_4_N
EXT5.LVDS_4_P: J14.14 ; port EXT5.LVDS_4_P
EXT5.LVDS_5_N: J14.18 ; port EXT5.LVDS_5_N
EXT5.LVDS_5_P: J14.17 ; port EXT5.LVDS_5_P
EXT5.LVDS_6_N: J14.21 ; port EXT5.LVDS_6_N
EXT5.LVDS_6_P: J14.20 ; port EXT5.LVDS_6_P
EXT5.LVDS_7_N: J14.24 ; port EXT5.LVDS_7_N
EXT5.LVDS_7_P: J14.23 ; port EXT5.LVDS_7_P
EXT6.LVDS_0_N: J15.3 ; port EXT6.LVDS_0_N
EXT6.LVDS_0_P: J15.2 ; port EXT6.LVDS_0_P
EXT6.LVDS_1_N: J15.6 ; port EXT6.LVDS_1_N
EXT6.LVDS_1_P: J15.5 ; port EXT6.LVDS_1_P
EXT6.LVDS_2_N: J15.9 ; port EXT6.LVDS_2_N
EXT6.LVDS_2_P: J15.8 ; port EXT6.LVDS_2_P
EXT6.LVDS_3_N: J15.12 ; port EXT6.LVDS_3_N
EXT6.LVDS_3_P: J15.11 ; port EXT6.LVDS_3_P
EXT6.LVDS_4_N: J15.15 ; port EXT6.LVDS_4_N
EXT6.LVDS_4_P: J15.14 ; port EXT6.LVDS_4_P
EXT6.LVDS_5_N: J15.18 ; port EXT6.LVDS_5_N
EXT6.LVDS_5_P: J15.17 ; port EXT6.LVDS_5_P
EXT6.LVDS_6_N: J15.21 ; port EXT6.LVDS_6_N
EXT6.LVDS_6_P: J15.20 ; port EXT6.LVDS_6_P
EXT6.LVDS_7_N: J15.24 ; port EXT6.LVDS_7_N
EXT6.LVDS_7_P: J15.23 ; port EXT6.LVDS_7_P
EXT7.LVDS_0_N: J16.3 ; port EXT7.LVDS_0_N
EXT7.LVDS_0_P: J16.2 ; port EXT7.LVDS_0_P
EXT7.LVDS_1_N: J16.6 ; port EXT7.LVDS_1_N
EXT7.LVDS_1_P: J16.5 ; port EXT7.LVDS_1_P
EXT7.LVDS_2_N: J16.9 ; port EXT7.LVDS_2_N
EXT7.LVDS_2_P: J16.8 ; port EXT7.LVDS_2_P
EXT7.LVDS_3_N: J16.12 ; port EXT7.LVDS_3_N
EXT7.LVDS_3_P: J16.11 ; port EXT7.LVDS_3_P
EXT7.LVDS_4_N: J16.15 ; port EXT7.LVDS_4_N
EXT7.LVDS_4_P: J16.14 ; port EXT7.LVDS_4_P
EXT7.LVDS_5_N: J16.18 ; port EXT7.LVDS_5_N
EXT7.LVDS_5_P: J16.17 ; port EXT7.LVDS_5_P
EXT7.LVDS_6_N: J16.21 ; port EXT7.LVDS_6_N
EXT7.LVDS_6_P: J16.20 ; port EXT7.LVDS_6_P
EXT7.LVDS_7_N: J16.24 ; port EXT7.LVDS_7_N
EXT7.LVDS_7_P: J16.23 ; port EXT7.LVDS_7_P
I2C_SCL_0: D3.3(I/O2) J9.27
I2C_SCL_1: D4.3(I/O2) J10.27
I2C_SCL_2: D5.3(I/O2) J11.27
I2C_SCL_3: D6.3(I/O2) J12.27
I2C_SCL_4: D7.3(I/O2) J13.27
I2C_SCL_5: D8.3(I/O2) J14.27
I2C_SCL_6: D9.3(I/O2) J15.27
I2C_SCL_7: D10.3(I/O2) J16.27
I2C_SDA_0: D3.2(I/O1) J9.26
I2C_SDA_1: D4.2(I/O1) J10.26
I2C_SDA_2: D5.2(I/O1) J11.26
I2C_SDA_3: D6.2(I/O1) J12.26
I2C_SDA_4: D7.2(I/O1) J13.26
I2C_SDA_5: D8.2(I/O1) J14.26
I2C_SDA_6: D9.2(I/O1) J15.26
I2C_SDA_7: D10.2(I/O1) J16.26
NetF1_2: F1.2 J9.30 J10.30 J11.30 J12.30
NetF2_2: F2.2 J13.30 J14.30 J15.30 J16.30

### Buses and harness runs
bus I2C_SCL_[7..0] = port I2C_SCL_[7..0]
bus I2C_SDA_[7..0] = port I2C_SDA_[7..0]
harness EXT0 = port EXT0
harness EXT1 = port EXT1
harness EXT2 = port EXT2
harness EXT3 = port EXT3

### Notes on the sheet
- Project/Equipment
- Document
- Designer
- Drawn by
- Check.by
- File
- Last Mod.
- Print Date
- Sheet
- Size
- A3
- of
- Rev

### Library data of the parts
C30 C35-C37 C39-C42 = CC0201_100NF_6.3V_10%_X5R: as C162-C171 on sheet FPGA_SDRAM; Part Number: CC0201_100NF_6.3V_10%_X5R; Component Kind: Standard; Component Type: Standard; Pin Count: 2; Value: 100nF; Status: Not Recommended; Manufacturer Part Number: CC0201_100NF_6.3V_10%_X5R; Case: 0201; Mounted: Yes; Socket: No; SMD: Yes; Sense: No; Manufacturer1 Example: AVX; Manufacturer1 ComponentHeight: 0.33mm; HelpURL: \\cern.ch\dfs\Applications\Altium\Datasheets\CC0201_X5R_AVX.pdf; Author: CERN DEM JLC; CreateDate: 2007-12-03; LatestRevisionDate: 2007-12-03
D3-D10 = PRTR5V0U2X: Ultra Low Capacitance Double Rail-to-Rail ESD Protection Diode; Part Description: Ultra Low Capacitance (1pF) Double Rail-to-Rail ESD Protection Diode (8kV); Manufacturer: NXP SEMICONDUCTORS; Voltage: 5.5V; PressFit: No; Bonding: No; Part Number: PRTR5V0U2X; Component Kind: Standard; Component Type: Standard; Device: PRTR5V0U2X; PackageDescription: SOT143B, SOT, 1.90mm Pitch; 4 Pin, 1.30mm W X 2.90mm L X 1.10mm H body, IPC Medium Density; Manufacturer Part Number: PRTR5V0U2X; Pin Count: 4; Case: SOT143B; Mounted: Yes; Socket: No; SMD: Yes; Sense: No; ComponentHeight: 1.1mm; HelpURL: \\cern.ch\dfs\Applications\Altium\Datasheets\PRTR5V0U2X.pdf; Author: CERN DEM JLC; CreateDate: 22.03.2011; LatestRevisionDate: 22.03.2011
F1 F2 = FUSR_LITTELFUSE_1206L012: Fuse; Part Description: POLYFUSE® Surface Mount Resettable PTC; Manufacturer Part Number: 1206L012WR; PressFit: No; Part Number: FUSR_LITTELFUSE_1206L012; Component Kind: Standard; Component Type: Standard; Pin Count: 2; PackageDescription: Surface Mount POLY-FUSE® Resettable PTC, 1206L Series; Family: Fuses Resettable; Mounted: Yes; Socket: No; SMD: Yes; Sense: No; Value: 125mA-30V; Manufacturer: LITTELFUSE; ComponentHeight: 1.45mm; HelpURL: \\cern.ch\dfs\Applications\Altium\Datasheets\FUSR_LITTELFUSE_1206L012.pdf; Author: CERN DEM JLC; CreateDate: 19.12.2011; LatestRevisionDate: 19.12.2011
J9-J16 = 3M_N2530-6002RB: Connector 30 Male; Part Description: 30 Contacts - Straight .100'' x .100'' Low Profile Four-Wall Header, 2500 Series; Manufacturer: 3M; PressFit: No; Part Number: 3M_N2530-6002RB; Component Kind: Standard; Component Type: Standard; Pin Count: 30; Family: Header 30; Mounted: Yes; Socket: No; SMD: No; Sense: No; Status: None; Manufacturer Part Number: N2530-6002RB; ComponentHeight: 10.03mm; HelpURL: \\cern.ch\dfs\Applications\Altium\Datasheets\3M_N2530-6002RB.pdf; Author: CERN DEM JLC; CreateDate: 11.02.2009; LatestRevisionDate: 11.08.2009

## Sheet USB_Serial_Quad.SchDoc: =ProjectName
size 420 x 297 mm; DrawnBy: P.K.; Address1: Warsaw Univeristy of Technology; Address2: Nowowiejska 15/19; DocumentNumber: 12; Revision: 1.1; SheetNumber: 12; SheetTotal: 12; EDA_Number: ARTIQ; Projet: ARTIQ/SINARA; ModifiedBy: -; CreateDate: XX/XX/XXXX; CheckedDate: -; Title2: USB_Serial_Quad.SchDoc; DivGrp: ISE; Designer: P.K.; ProjectName: ARTIQ/SINARA
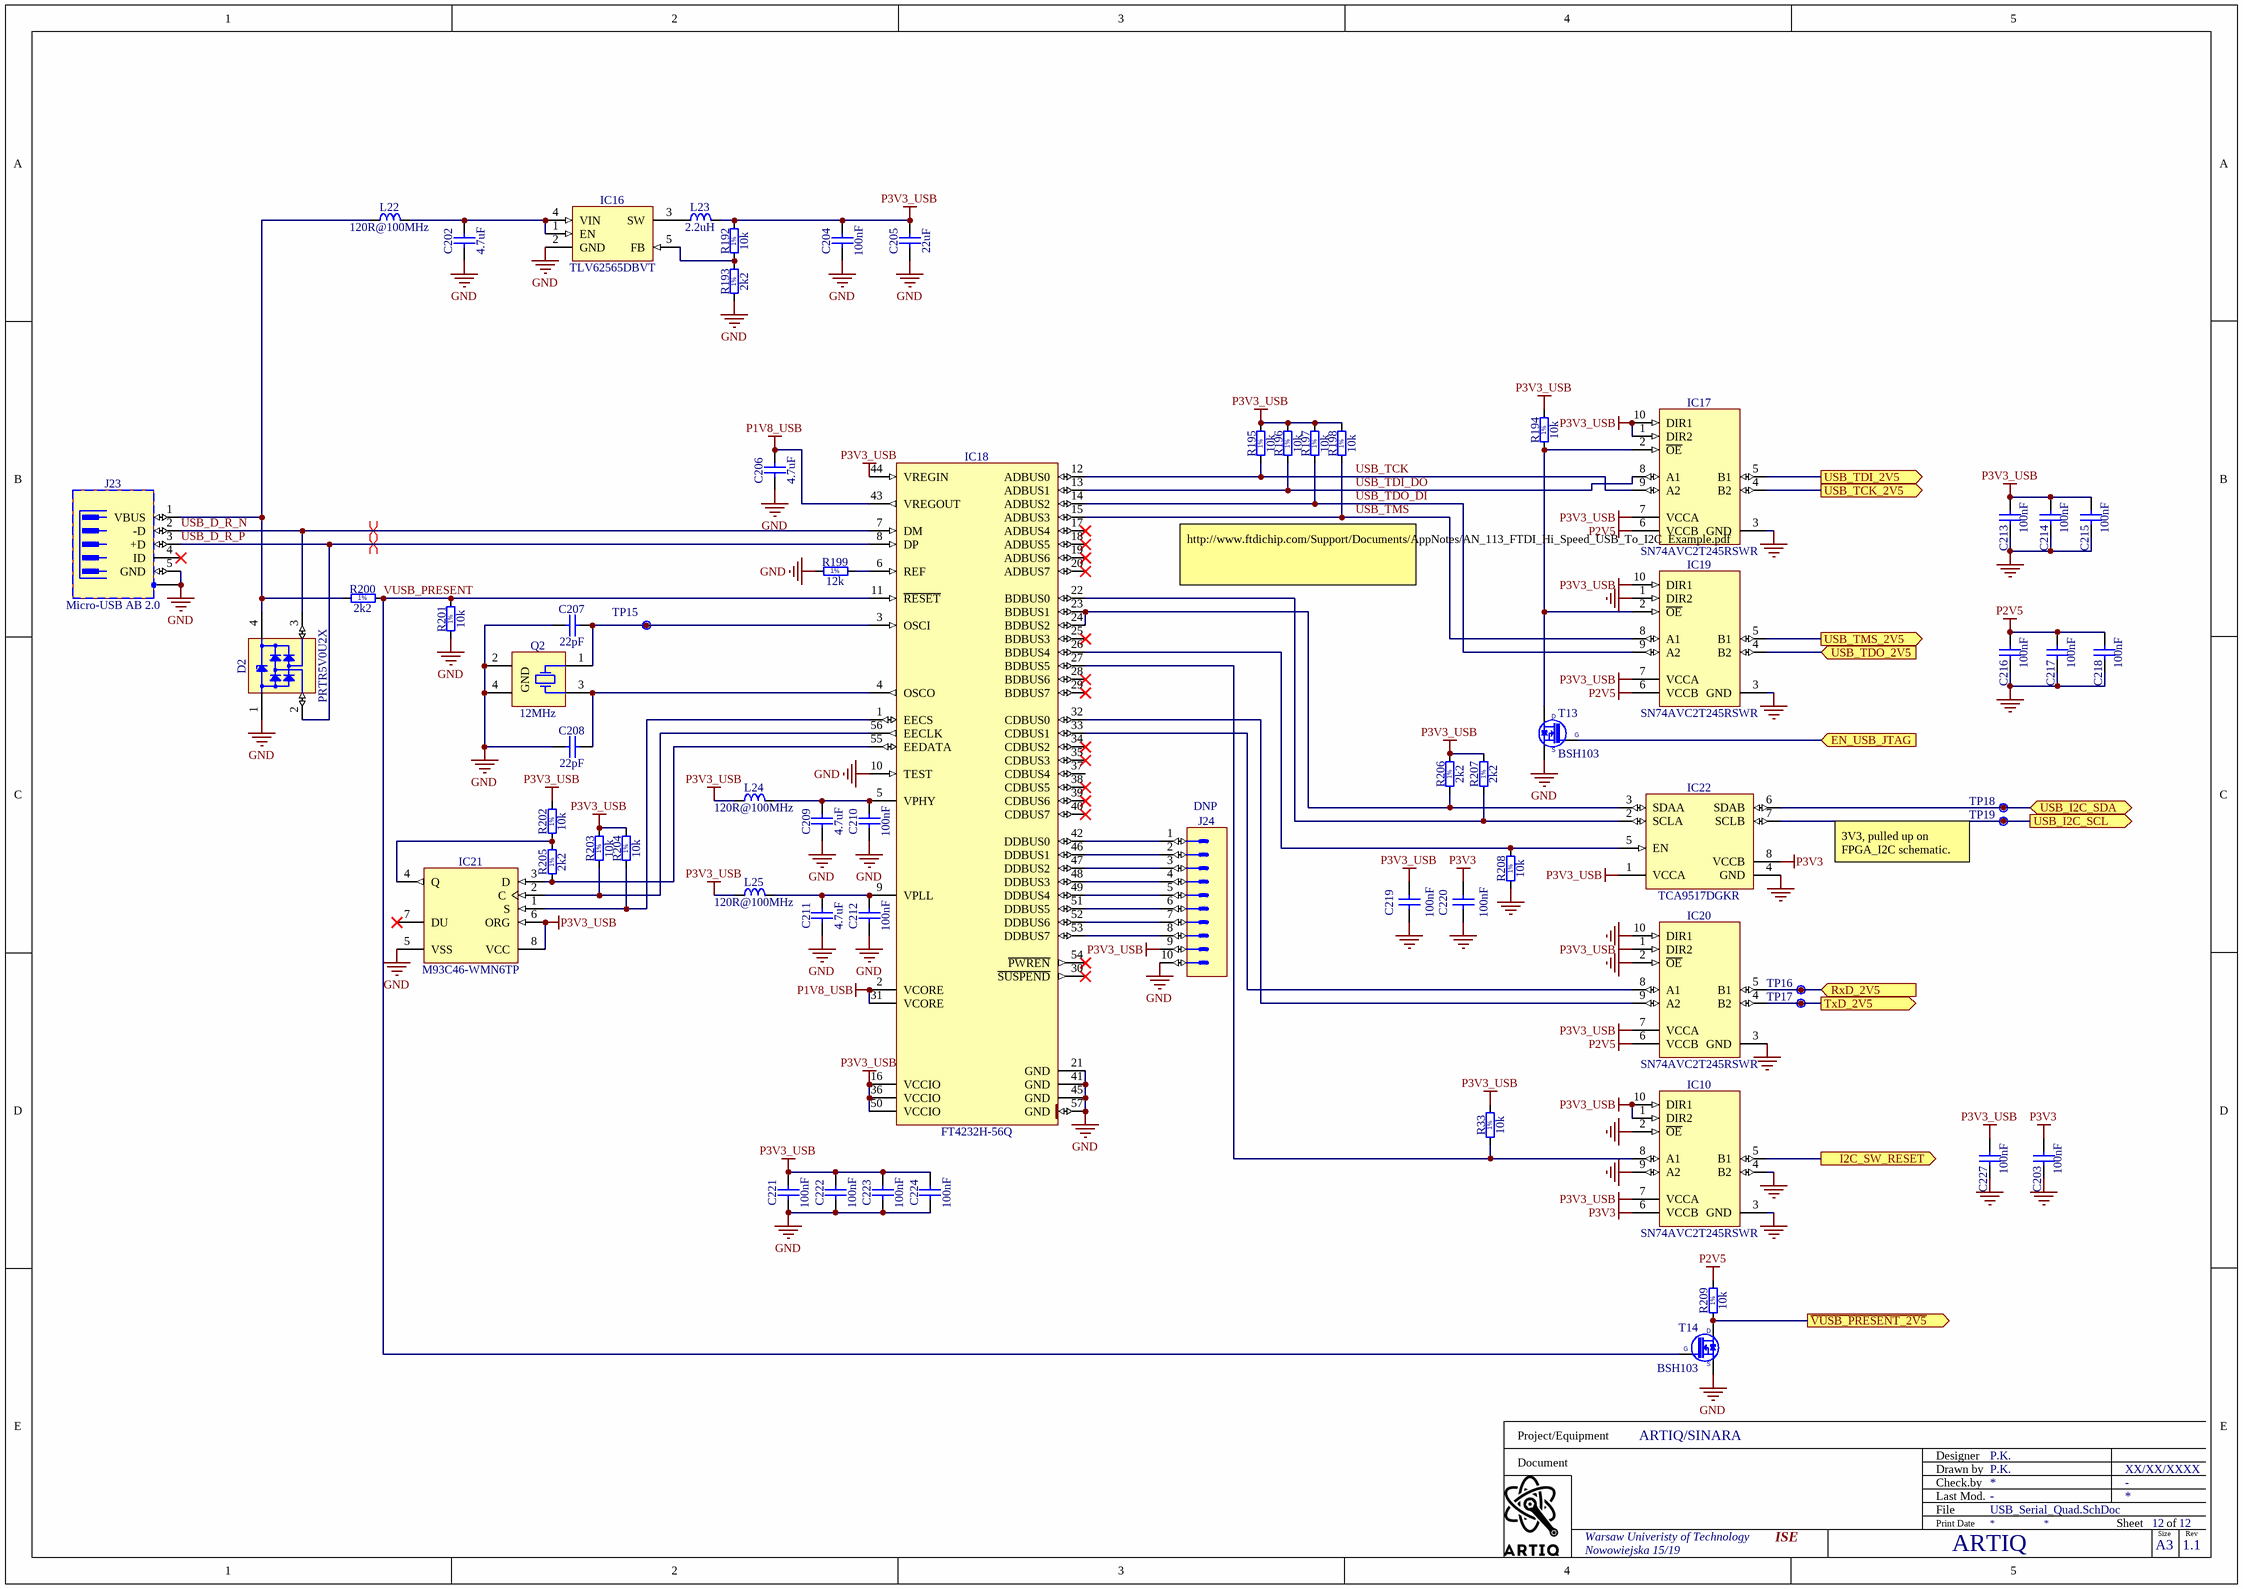
[diagram p11: USB_Serial_Quad.SchDoc]

### Parts
C202  4.7uF  [CAPC2012X135N]
C203  100nF  [CAPC0603X33N]
C204  100nF  [CAPC0603X33N]
C205  22uF  [CAPC1709X100N]
C206  4.7uF  [CAPC2012X135N]
C207  22pF  [CAPC1005X55N]
C208  22pF  [CAPC1005X55N]
C209  4.7uF  [CAPC2012X135N]
C210  100nF  [CAPC0603X33N]
C211  4.7uF  [CAPC2012X135N]
C212  100nF  [CAPC0603X33N]
C213  100nF  [CAPC0603X33N]
C214  100nF  [CAPC0603X33N]
C215  100nF  [CAPC0603X33N]
C216  100nF  [CAPC0603X33N]
C217  100nF  [CAPC0603X33N]
C218  100nF  [CAPC0603X33N]
C219  100nF  [CAPC0603X33N]
C220  100nF  [CAPC0603X33N]
C221  100nF  [CAPC0603X33N]
C222  100nF  [CAPC0603X33N]
C223  100nF  [CAPC0603X33N]
C224  100nF  [CAPC0603X33N]
C227  100nF  [CAPC0603X33N]
D2  PRTR5V0U2X  [SOT190P230X110-4N]
IC10  SN74AVC2T245RSWR  [QFN40P140X180X55-10N]
IC16  TLV62565DBVT  [SOT95P280X145-5N]
IC17  SN74AVC2T245RSWR  [QFN40P140X180X55-10N]
IC18  FT4232H-56Q  [QFN50P800X800X100-57N-S620]
IC19  SN74AVC2T245RSWR  [QFN40P140X180X55-10N]
IC20  SN74AVC2T245RSWR  [QFN40P140X180X55-10N]
IC21  M93C46-WMN6TP  [SOIC127P600X175-8N]
IC22  TCA9517DGKR  [SOP65P490X110-8N]
J23  Micro-USB AB 2.0  [HIROSE_ZX62RD-AB-5P8]
J24  Header 10  [SAMTEC_TSW-105-07-L-D-LL]  (value not drawn)
L22  120R@100MHz  [INDC1608X65N]
L23  2.2uH  [IND_WURTH_WE-PMCI_0806LR]
L24  120R@100MHz  [INDC1608X65N]
L25  120R@100MHz  [INDC1608X65N]
Q2  12MHz  [XTAL_TXC_7M]
R33  10k  [RESC1005X40N]
R192  10k  [RESC1005X40N]
R193  2k2  [RESC1005X40N]
R194  10k  [RESC1005X40N]
R195  10k  [RESC1005X40N]
R196  10k  [RESC1005X40N]
R197  10k  [RESC1005X40N]
R198  10k  [RESC1005X40N]
R199  12k  [RESC1005X40N]
R200  2k2  [RESC1005X40N]
R201  10k  [RESC1005X40N]
R202  10k  [RESC1005X40N]
R203  10k  [RESC1005X40N]
R204  10k  [RESC1005X40N]
R205  2k2  [RESC1005X40N]
R206  2k2  [RESC1005X40N]
R207  2k2  [RESC1005X40N]
R208  10k  [RESC1005X40N]
R209  10k  [RESC1005X40N]
T13  BSH103  [SOT95P230X110-3N]
T14  BSH103  [SOT95P230X110-3N]
TP15  Q2  [TPS127]  (value not drawn)
TP16  RxD  [TPS127]  (value not drawn)
TP17  TxD  [TPS127]  (value not drawn)
TP18  USB I2C SDA  [TPS127]  (value not drawn)
TP19  USB I2C SCL  [TPS127]  (value not drawn)

### Ports
EN_USB_JTAG (in), I2C_SW_RESET (out), RxD_2V5 (in), TxD_2V5 (out), USB_I2C_SCL (out), USB_I2C_SDA (bidir), USB_TCK_2V5 (out), USB_TDI_2V5 (out), USB_TDO_2V5 (in), USB_TMS_2V5 (out), ~{VUSB_PRESENT_2V5} (out)

### Nets
GND: C202.1 C203.1 C204.1 C205.1 C206.1 C207.1 C208.1 C209.1 C210.1 C211.1 C212.1 C213.1 C214.1 C215.1 C216.1 C217.1 C218.1 C219.1 C220.1 C221.1 C222.1 C223.1 C224.1 C227.1 D2.1(GND) IC10.2(~{OE}) IC10.3(GND) IC10.4(B2) IC10.9(A2) IC16.2(GND) IC17.3(GND) IC18.10(TEST) IC18.21(GND) IC18.41(GND) IC18.45(GND) IC18.57(GND) IC19.1(DIR2) IC19.3(GND) IC20.2(~{OE}) IC20.3(GND) IC20.10(DIR1) IC21.5(VSS) IC22.4(GND) J23.5(GND) J23.6(SH) J24.10 Q2.2(GND) Q2.4(GND) R193.1 R199.1 R201.1 R208.1 T13.2(S) T14.2(S)
P1V8_USB: C206.2 IC18.2(VCORE) IC18.31(VCORE) IC18.43(VREGOUT)
P2V5: C216.2 C217.2 C218.2 IC17.6(VCCB) IC19.6(VCCB) IC20.6(VCCB) R209.2
P3V3: C203.2 C220.2 IC10.6(VCCB) IC22.8(VCCB)
P3V3_USB: C204.2 C205.2 C213.2 C214.2 C215.2 C219.2 C221.2 C222.2 C223.2 C224.2 C227.2 IC10.1(DIR2) IC10.7(VCCA) IC10.10(DIR1) IC17.1(DIR2) IC17.7(VCCA) IC17.10(DIR1) IC18.16(VCCIO) IC18.36(VCCIO) IC18.44(VREGIN) IC18.50(VCCIO) IC19.7(VCCA) IC19.10(DIR1) IC20.1(DIR2) IC20.7(VCCA) IC21.6(ORG) IC21.8(VCC) IC22.1(VCCA) J24.9 L23.2 L24.1 L25.1 R33.2 R192.2 R194.2 R195.2 R196.2 R197.2 R198.2 R202.2 R203.2 R204.2 R206.2 R207.2
~{VUSB_PRESENT_2V5}: R209.1 T14.3(D) ; port ~{VUSB_PRESENT_2V5}
CFG_TCK: IC17.4(B2) ; port USB_TCK_2V5
CFG_TDI: IC17.5(B1) ; port USB_TDI_2V5
CFG_TDO: IC19.4(B2) ; port USB_TDO_2V5
CFG_TMS: IC19.5(B1) ; port USB_TMS_2V5
I2C_3V3_SCL: IC22.7(SCLB) TP19.1 ; port USB_I2C_SCL
I2C_3V3_SDA: IC22.6(SDAB) TP18.1 ; port USB_I2C_SDA
I2C_SW_RESET: IC10.5(B1) ; port I2C_SW_RESET
RxD_2V5: IC20.5(B1) TP16.1 ; port RxD_2V5
TxD_2V5: IC20.4(B2) TP17.1 ; port TxD_2V5
USB_D_R_N: D2.3(I/O2) IC18.7(DM) J23.2(-D)
USB_D_R_P: D2.2(I/O1) IC18.8(DP) J23.3(+D)
USB_TCK: IC17.9(A2) IC18.12(ADBUS0) R195.1
USB_TDI_DO: IC17.8(A1) IC18.13(ADBUS1) R196.1
USB_TDO_DI: IC18.14(ADBUS2) IC19.9(A2) R197.1
USB_TMS: IC18.15(ADBUS3) IC19.8(A1) R198.1
VUSB_PRESENT: IC18.11(~{RESET}) R200.2 R201.2 T14.1(G)
NetC53_2: T13.1(G) ; port EN_USB_JTAG
NetC202_2: C202.2 IC16.1(EN) IC16.4(VIN) L22.2
NetC207_2: C207.2 IC18.3(OSCI) Q2.1(X) TP15.1
NetC208_2: C208.2 IC18.4(OSCO) Q2.3(X)
NetC209_2: C209.2 C210.2 IC18.5(VPHY) L24.2
NetC211_2: C211.2 C212.2 IC18.9(VPLL) L25.2
NetD2_4: D2.4(VCC) J23.1(VBUS) L22.1 R200.1
NetIC10_8: IC10.8(A1) IC18.27(BDBUS5) R33.1
NetIC16_3: IC16.3(SW) L23.1
NetIC16_5: IC16.5(FB) R192.1 R193.2
NetIC17_2: IC17.2(~{OE}) IC19.2(~{OE}) R194.1 T13.3(D)
NetIC18_1: IC18.1(EECS) IC21.1(S) R204.1
NetIC18_6: IC18.6(REF) R199.2
NetIC18_22: IC18.22(BDBUS0) IC22.2(SCLA) R207.1
NetIC18_23: IC18.23(BDBUS1) IC18.24(BDBUS2) IC22.3(SDAA) R206.1
NetIC18_26: IC18.26(BDBUS4) IC22.5(EN) R208.2
NetIC18_32: IC18.32(CDBUS0) IC20.9(A2)
NetIC18_33: IC18.33(CDBUS1) IC20.8(A1)
NetIC18_42: IC18.42(DDBUS0) J24.1
NetIC18_46: IC18.46(DDBUS1) J24.2
NetIC18_47: IC18.47(DDBUS2) J24.3
NetIC18_48: IC18.48(DDBUS3) J24.4
NetIC18_49: IC18.49(DDBUS4) J24.5
NetIC18_51: IC18.51(DDBUS5) J24.6
NetIC18_52: IC18.52(DDBUS6) J24.7
NetIC18_53: IC18.53(DDBUS7) J24.8
NetIC18_55: IC18.55(EEDATA) IC21.3(D) R205.2
NetIC18_56: IC18.56(EECLK) IC21.2(C) R203.1
NetIC21_4: IC21.4(Q) R202.1 R205.1

Not connected (* = marked no-connect by the designer): IC18 17(ADBUS4)* 18(ADBUS5)* 19(ADBUS6)* 20(ADBUS7)* 25(BDBUS3)* 28(BDBUS6)* 29(BDBUS7)* 30(~{SUSPEND})* 34(CDBUS2)* 35(CDBUS3)* 37(CDBUS4) 38(CDBUS5)* 39(CDBUS6)* 40(CDBUS7)* 54(~{PWREN})*; IC21 7(DU)*; J23 4(ID)*

### Layout directives
differential pair: USB_D_R_N, USB_D_R_P

### Notes on the sheet
- http://www.ftdichip.com/Support/Documents/AppNotes/AN_113_FTDI_Hi_Speed_USB_To_I2C_Example.pdf
- (near J24) DNP
- 3V3, pulled up on FPGA_I2C schematic.
- Project/Equipment
- Document
- Designer
- Drawn by
- Check.by
- File
- Last Mod.
- Print Date
- Sheet
- Size
- A3
- of
- Rev
- (in symbol R0402_2K2_1%_0.0625W_100PPM) 1%
- (in symbol R0402_10K_1%_0.0625W_100PPM) 1%
- (in symbol R0402_12K_1%_0.0625W_100PPM) 1%

### Library data of the parts
C202 C206 C209 C211 = CC0805_4.7UF_10V_10%_X5R: Non-polarised capacitor; Part Description: SMD Multilayer Chip Ceramic Capacitor; Manufacturer: GENERIC; Manufacturer1 Part Number: 222224013672; Voltage: 10V; TC: X5R; Tolerance: ±10%; Part Number: CC0805_4.7UF_10V_10%_X5R; Component Kind: Standard; Component Type: Standard; Pin Count: 2; Value: 4.7uF; Status: Preferred; Manufacturer Part Number: CC0805_4.7UF_10V_10%_X5R; Case: 0805; Mounted: Yes; Socket: No; SMD: Yes; Sense: No; Manufacturer1 Example: PHYCOMP; Manufacturer1 ComponentHeight: 1.45mm; HelpURL: \\cern.ch\dfs\Applications\Altium\Datasheets\CC0805_X5R_PHYCOMP_HC.pdf; Author: CERN DEM JLC; CreateDate: 03.12.2007; LatestRevisionDate: 03.12.2007
C203 C204 C210 C212-C224 C227 = CC0201_100NF_6.3V_10%_X5R: as C162-C171 on sheet FPGA_SDRAM; Part Number: CC0201_100NF_6.3V_10%_X5R; Component Kind: Standard; Component Type: Standard; Pin Count: 2; Value: 100nF; Status: Not Recommended; Manufacturer Part Number: CC0201_100NF_6.3V_10%_X5R; Case: 0201; Mounted: Yes; Socket: No; SMD: Yes; Sense: No; Manufacturer1 Example: AVX; Manufacturer1 ComponentHeight: 0.33mm; HelpURL: \\cern.ch\dfs\Applications\Altium\Datasheets\CC0201_X5R_AVX.pdf; Author: CERN DEM JLC
  C203 C213-C220 C227: CreateDate: 2007-12-03; LatestRevisionDate: 2007-12-03
  C204 C210 C212 C221-C224: CreateDate: 03.12.2007; LatestRevisionDate: 03.12.2007
C205 = CC0603_22UF_6.3V_20%_X5R: as C173 on sheet FPGA_SDRAM; Part Number: CC0603_22UF_6.3V_20%_X5R; Component Kind: Standard; Component Type: Standard; Pin Count: 2; Value: 22uF; Status: None; Manufacturer Part Number: CC0603_22UF_6.3V_20%_X5R; Case: 0603; Mounted: Yes; Socket: No; SMD: Yes; Sense: No; Manufacturer1 Example: TDK; Manufacturer1 ComponentHeight: 1mm; HelpURL: \\cern.ch\dfs\Applications\Altium\Datasheets\CC0603_X5R_TDK_C.pdf; Author: CERN DEM JLC; CreateDate: 16.12.2013; LatestRevisionDate: 13.09.2016; ClassName: Artix
C207 C208 = CC0402_22PF_50V_5%_C0G: Non-polarised capacitor; Part Description: SMD Multilayer Chip Ceramic Capacitor; Manufacturer: GENERIC; Manufacturer1 Part Number: C0402C220J5GACTU; Voltage: 50V; TC: C0G/NP0; Tolerance: ±5%; Part Number: CC0402_22PF_50V_5%_C0G; Component Kind: Standard; Component Type: Standard; Pin Count: 2; Value: 22pF; Status: Preferred; Manufacturer Part Number: CC0402_22PF_50V_5%_C0G; Case: 0402; Mounted: Yes; Socket: No; SMD: Yes; Sense: No; Manufacturer1 Example: KEMET; Manufacturer1 ComponentHeight: 0.55mm; HelpURL: \\cern.ch\dfs\Applications\Altium\Datasheets\CC0805_C0G_KEMET_(Commercial Grade).pdf; Author: CERN DEM JLC; CreateDate: 03.12.2007; LatestRevisionDate: 03.12.2007
D2 = PRTR5V0U2X: as D3-D10 on sheet IDC_EXT_Connectors; Part Number: PRTR5V0U2X; Component Kind: Standard; Component Type: Standard; Device: PRTR5V0U2X; PackageDescription: SOT143B, SOT, 1.90mm Pitch; 4 Pin, 1.30mm W X 2.90mm L X 1.10mm H body, IPC Medium Density; Manufacturer Part Number: PRTR5V0U2X; Pin Count: 4; Case: SOT143B; Mounted: Yes; Socket: No; SMD: Yes; Sense: No; ComponentHeight: 1.1mm; HelpURL: \\cern.ch\dfs\Applications\Altium\Datasheets\PRTR5V0U2X.pdf; Author: CERN DEM JLC; CreateDate: 22.03.2011; LatestRevisionDate: 22.03.2011
IC10 IC17 IC19 IC20 = SN74AVC2T245RSWR: Dual-Bit Dual-Supply Bus Transceiver With Configurable Voltage Translation and 3-State Outputs; Manufacturer: TEXAS INSTRUMENTS; PressFit: No; Bonding: No; Part Number: SN74AVC2T245RSWR; Component Kind: Standard; Component Type: Standard; Device: SN74AVC2T245RSWR; PackageDescription: QFN, 0.40mm Pitch, Rect.;10 Pin, 1.80mm L X 1.40mm W X 0.55mm H Body, IPC Medium Density; Status: Not Recommended; Part Description: Dual-Bit Dual-Supply Bus Transceiver With Configurable Voltage Translation and 3-State Outputs; Manufacturer Part Number: SN74AVC2T245RSWR; Pin Count: 10; Case: QFN10; Mounted: Yes; Socket: No; SMD: Yes; Sense: No; ComponentHeight: 0.55mm; Author: CERN DEM JLC; HelpURL: \\cern.ch\dfs\Applications\Altium\Datasheets\SN74AVC2T245RSWR.pdf; CreateDate: 07.07.2014; LatestRevisionDate: 30.03.2017
IC16 = TLV62565DBVT: 1.5A High Efficiency Step-Down Converter, Adjustable Output Voltage; Manufacturer: TEXAS INSTRUMENTS; PressFit: No; Bonding: No; Part Number: TLV62565DBVT; Component Kind: Standard; Component Type: Standard; Device: TLV62565DBVT; PackageDescription: SOT, 0.95mm Pitch; 5 Pin, 1.60mm W X 2.90mm L X 1.45mm H Body, IPC Medium Density; Part Description: 1.5A High Efficiency Step-Down Converter, Adjustable Output Voltage; Manufacturer Part Number: TLV62565DBVT; Pin Count: 5; Case: SOT23-5; Mounted: Yes; Socket: No; SMD: Yes; Sense: No; ComponentHeight: 1.45mm; HelpURL: \\cern.ch\dfs\Applications\Altium\Datasheets\TLV62565DBVT.pdf; Author: CERN DEM JMW; CreateDate: 29.08.2016; LatestRevisionDate: 29.08.2016
IC18 = FT4232H-56Q: Quad High Speed USB to Multipurpose UART/MPSSE IC; Manufacturer: FUTURE TECHNOLOGY DEVICES INTERNATIONAL (FTDI); PressFit: No; Bonding: No; Part Number: FT4232H-56Q; Component Kind: Standard; Component Type: Standard; Device: FT4232H-56Q; PackageDescription: QFN, 0.50mm Pitch, Square; 56 Pin, 8.00mm L X 8.00mm W X 1.00mm H body (6.1mm X 6.1mm Thermal tab), IPC Medium Density; Part Description: Quad High Speed USB to Multipurpose UART/MPSSE IC; Manufacturer Part Number: FT4232H-56Q; Pin Count: 57; Case: QFN56; Mounted: Yes; Socket: No; SMD: Yes; Sense: No; ComponentHeight: 1mm; Author: CERN DEM JLC; HelpURL: \\cern.ch\dfs\Applications\Altium\Datasheets\FT4232H-56Q.pdf; CreateDate: 11.10.2016; LatestRevisionDate: 11.10.2016
IC21 = M93C46-WMN6TP: 2.5 to 5.5 V, 1Kb (128x8) Serial Microwire Bus EEPROM; Part Description: 1Kbit (128 x 8 bit or 64 x 16 bit) MICROWIRE® Serial Access EEPROM; Manufacturer: ST MICROELECTRONICS; PressFit: No; Bonding: No; Part Number: M93C46-WMN6TP; Component Kind: Standard; Component Type: Standard; Device: M93C46-WMN6TP; PackageDescription: SOIC 8, Pitch 1.27mm - Body 4x5mm, IPC Medium Density; Manufacturer Part Number: M93C46-WMN6TP; Pin Count: 8; Case: SOIC8; Mounted: Yes; Socket: No; SMD: Yes; Sense: No; ComponentHeight: 1.75mm; HelpURL: \\cern.ch\dfs\Applications\Altium\Datasheets\M93C46-WMN6TP.pdf; Author: CERN DEM JLC; CreateDate: 15.11.2012; LatestRevisionDate: 15.11.2012
IC22 = TCA9517DGKR: Level-Translating I2C Bus Repeater; Manufacturer: TEXAS INSTRUMENTS; PressFit: No; Bonding: No; Part Number: TCA9517DGKR; Component Kind: Standard; Component Type: Standard; Device: TCA9517DGKR; PackageDescription: SOP, 0.65mm, Pitch; 8 Pin, 3.0mm W X 3.0mm L X 1.10mm H Body, IPC Medium Density; Part Description: Level-Translating I2C Bus Repeater; Manufacturer Part Number: TCA9517DGKR; Pin Count: 8; Case: TSSOP8; Mounted: Yes; Socket: No; SMD: Yes; Sense: No; ComponentHeight: 1.1mm; Author: CERN DEM JLC; HelpURL: \\cern.ch\dfs\Applications\Altium\Datasheets\TCA9517DGKR.pdf; CreateDate: 07.07.2014; LatestRevisionDate: 07.07.2014
J23 = HIROSE_ZX62RD-AB-5P8: 5 Pin + 1 Shield USB Receptacle; Part Description: Micro-USB 2.0 Right Angle, SMD Type AB - Reverse (Top mount), Shell Through Hole; Manufacturer: HIROSE (HRS); PressFit: No; Part Number: HIROSE_ZX62RD-AB-5P8; Component Kind: Standard; Component Type: Standard; Pin Count: 7; Family: Micro-USB AB 2.0; Mounted: Yes; Socket: No; SMD: Yes; Sense: No; Status: None; Manufacturer Part Number: ZX62RD-AB-5P8; ComponentHeight: 2.35mm; HelpURL: \\cern.ch\dfs\Applications\Altium\Datasheets\HIROSE_ZX62RD-AB-5P8.pdf; ComponentLink1URL: \\cern.ch\dfs\Applications\Altium\Datasheets\HIROSE_ZX62RD-AB-5P8_Package-Drawing.pdf; ComponentLink1Description: Package-Drawing; Author: CERN DEM JLC; CreateDate: 29.10.2014; LatestRevisionDate: 29.10.2014; ClassName: Connectors
J24 = SAMTEC_TSW-105-07-L-D-LL: Connector 10 Male; Part Description: 10 Contacts, Pitch 2.54mm, Dual Row Through Mount  Straight Header With Locking Lead (Lead Length 2.54mm); Manufacturer: SAMTEC; PressFit: No; Part Number: SAMTEC_TSW-105-07-L-D-LL; Component Kind: Standard; Component Type: Standard; Pin Count: 10; Family: Header 10; Mounted: Yes; Socket: No; SMD: No; Sense: No; Status: None; Manufacturer Part Number: TSW-105-07-L-D-LL; ComponentHeight: 8.38mm; HelpURL: \\cern.ch\dfs\Applications\Altium\Datasheets\SAMTEC_TSW-105-07-L-D-LL.pdf; Author: CERN DEM JLC; CreateDate: 2012-01-23; LatestRevisionDate: 2012-07-26
L22 L24 L25 = IND0603_MURATA_BLM18SG121TN1D: Inductor; Part Description: SMD EMIFIL Suppression Chip Ferrite Bead; Manufacturer: MURATA; Power: 3A; Resistance: 0.025R; Tolerance: ±25%; Part Number: IND0603_MURATA_BLM18SG121TN1D; Component Kind: Standard; Component Type: Standard; Pin Count: 2; Value: 120R@100MHz; Status: None; Manufacturer Part Number: BLM18SG121TN1D; Case: 0603; Mounted: Yes; Socket: No; SMD: Yes; Sense: No; ComponentHeight: 0.65mm; HelpURL: \\cern.ch\dfs\Applications\Altium\Datasheets\IND0603_MURATA_BLM18S.pdf; Author: CERN DEM JLC; CreateDate: 23.07.2014; LatestRevisionDate: 23.07.2014
L23 = IND_2.2UH_20%_WURTH_WE-PMCI_74479276222C: Inductor; Part Description: SMD Power Molded Chip  Inductor (WE-PMCI Series); Manufacturer: WURTH ELEKTRONIK; Power: 1.1A; Resistance: 0.112R; Tolerance: ±20%; Part Number: IND_2.2UH_20%_WURTH_WE-PMCI_74479276222C; Component Kind: Standard; Component Type: Standard; Pin Count: 2; Value: 2.2uH; Status: None; Manufacturer Part Number: 74479276222C; Case: 0806; Mounted: Yes; Socket: No; SMD: Yes; Sense: No; ComponentHeight: 1mm; HelpURL: \\cern.ch\dfs\Applications\Altium\Datasheets\IND_WURTH_WE-PMCI_74479276222C.pdf; Author: CERN DEM JLC; CreateDate: 20.10.2016; LatestRevisionDate: 20.10.2016
Q2 = XTAL_12MHZ_TXC_7M-12.000MAAJ-T: Crystal 4 pins 1=XTAL Control 2=GND3=XTAL 4=GND; Part Description: ±30ppm 18pF -20°C to +70°C  4 Pins, 3.2x2.5X0.8mm, SMD Sealing Crystal, 7M Series; Manufacturer: TXC CORPORATION; PressFit: No; Bonding: No; Part Number: XTAL_12MHZ_TXC_7M-12.000MAAJ-T; Component Kind: Standard; Component Type: Standard; PackageDescription: 4 Pins, 2.5x3.2mm, SMD Sealing Crystal, 7M Serie; Value: 12MHz; Manufacturer Part Number: 7M-12.000MAAJ-T; Pin Count: 4; Mounted: Yes; Socket: No; SMD: Yes; Sense: No; ComponentHeight: 0.8mm; HelpURL: \\cern.ch\dfs\Applications\Altium\Datasheets\XTAL_TXC_7M.pdf; Author: CERN DEM JLC; CreateDate: 19.06.2012; LatestRevisionDate: 19.06.2012
R33 R192 R194-R198 R201-R204 R208 R209 = R0402_10K_1%_0.0625W_100PPM: as R127-R129 on sheet FPGA_SDRAM; Part Number: R0402_10K_1%_0.0625W_100PPM; Component Kind: Standard; Component Type: Standard; Pin Count: 2; Value: 10k; Status: Not Recommended; Power: 0.0625W; Tolerance: ±1%; Manufacturer Part Number: R0402_10K_1%_0.0625W_100PPM; Case: 0402; Mounted: Yes; Sense: No; Socket: No; SMD: Yes; Manufacturer1 Example: YAGEO PHYCOMP; Manufacturer1 ComponentHeight: 0.4mm; HelpURL: \\cern.ch\dfs\Applications\Altium\Datasheets\R0402_Phycomp_RC0402.pdf; Author: CERN DEM JLC; CreateDate: 03.12.2007; LatestRevisionDate: 17.10.2012
R193 R200 R205-R207 = R0402_2K2_1%_0.0625W_100PPM: Resistor - 1%; Part Description: General Purpose Thick Film Chip Resistor; Manufacturer: GENERIC; Manufacturer1 Part Number: 232270672202L; TC: ±100ppm/°C; PressFit: No; Part Number: R0402_2K2_1%_0.0625W_100PPM; Component Kind: Standard; Component Type: Standard; Pin Count: 2; Value: 2k2; Status: Not Recommended; Power: 0.0625W; Tolerance: ±1%; Manufacturer Part Number: R0402_2K2_1%_0.0625W_100PPM; Case: 0402; Mounted: Yes; Sense: No; Socket: No; SMD: Yes; Manufacturer1 Example: YAGEO PHYCOMP; Manufacturer1 ComponentHeight: 0.4mm; HelpURL: \\cern.ch\dfs\Applications\Altium\Datasheets\R0402_Phycomp_RC0402.pdf; Author: CERN DEM JLC; CreateDate: 03.12.2007; LatestRevisionDate: 17.10.2012
R199 = R0402_12K_1%_0.0625W_100PPM: Resistor - 1%; Part Description: General Purpose Thick Film Chip Resistor; Manufacturer: GENERIC; Manufacturer1 Part Number: 232270671203L; TC: ±100ppm/°C; PressFit: No; Part Number: R0402_12K_1%_0.0625W_100PPM; Component Kind: Standard; Component Type: Standard; Pin Count: 2; Value: 12k; Status: Not Recommended; Power: 0.0625W; Tolerance: ±1%; Manufacturer Part Number: R0402_12K_1%_0.0625W_100PPM; Case: 0402; Mounted: Yes; Sense: No; Socket: No; SMD: Yes; Manufacturer1 Example: YAGEO PHYCOMP; Manufacturer1 ComponentHeight: 0.4mm; HelpURL: \\cern.ch\dfs\Applications\Altium\Datasheets\R0402_Phycomp_RC0402.pdf; Author: CERN DEM JLC; CreateDate: 03.12.2007; LatestRevisionDate: 17.10.2012
T13 T14 = BSH103: N-CHANNEL MOSFET WITH DIODE; Part Description: 30V 850mA N-Channel Enhancement Mode Field-Effect Transistor; Manufacturer: NEXPERIA; PressFit: No; Bonding: No; Part Number: BSH103; Component Kind: Standard; Component Type: Standard; Device: BSH103; PackageDescription: SOT23, 3 pin, Pitch 0.95mm - 1.3mm W X 2.9mm L X 1.1mm H, IPC Medium Density; Manufacturer Part Number: BSH103; Pin Count: 3; Case: SOT23-3; Mounted: Yes; Socket: No; SMD: Yes; Sense: No; ComponentHeight: 1.1mm; HelpURL: \\cern.ch\dfs\Applications\Altium\Datasheets\BSH103.pdf; Author: CERN DEM JLC; CreateDate: 16.03.2010; LatestRevisionDate: 20.06.2017
TP15-TP19 = SMD_PAD_1.27X1.27MM: Test Point; Part Description: 1.27mm x 1.27mm PCB Copper Area (SMD Test Point); Mounted: No; Part Number: SMD_PAD_1.27X1.27MM; Component Kind: Standard (No BOM); Component Type: Standard (No BOM); Pin Count: 1; Family: Test Point; Socket: No; SMD: Yes; Sense: No; Status: None; ComponentHeight: 0mm; HelpURL: Undefined; Author: CERN DEM JLC; CreateDate: 12.01.2008; LatestRevisionDate: 12.01.2008; PackageDescription: 1.27mm x 1.27mm PCB Copper Area (SMD Test Point)